# Altium project Tuna_Hub.PrjPcb
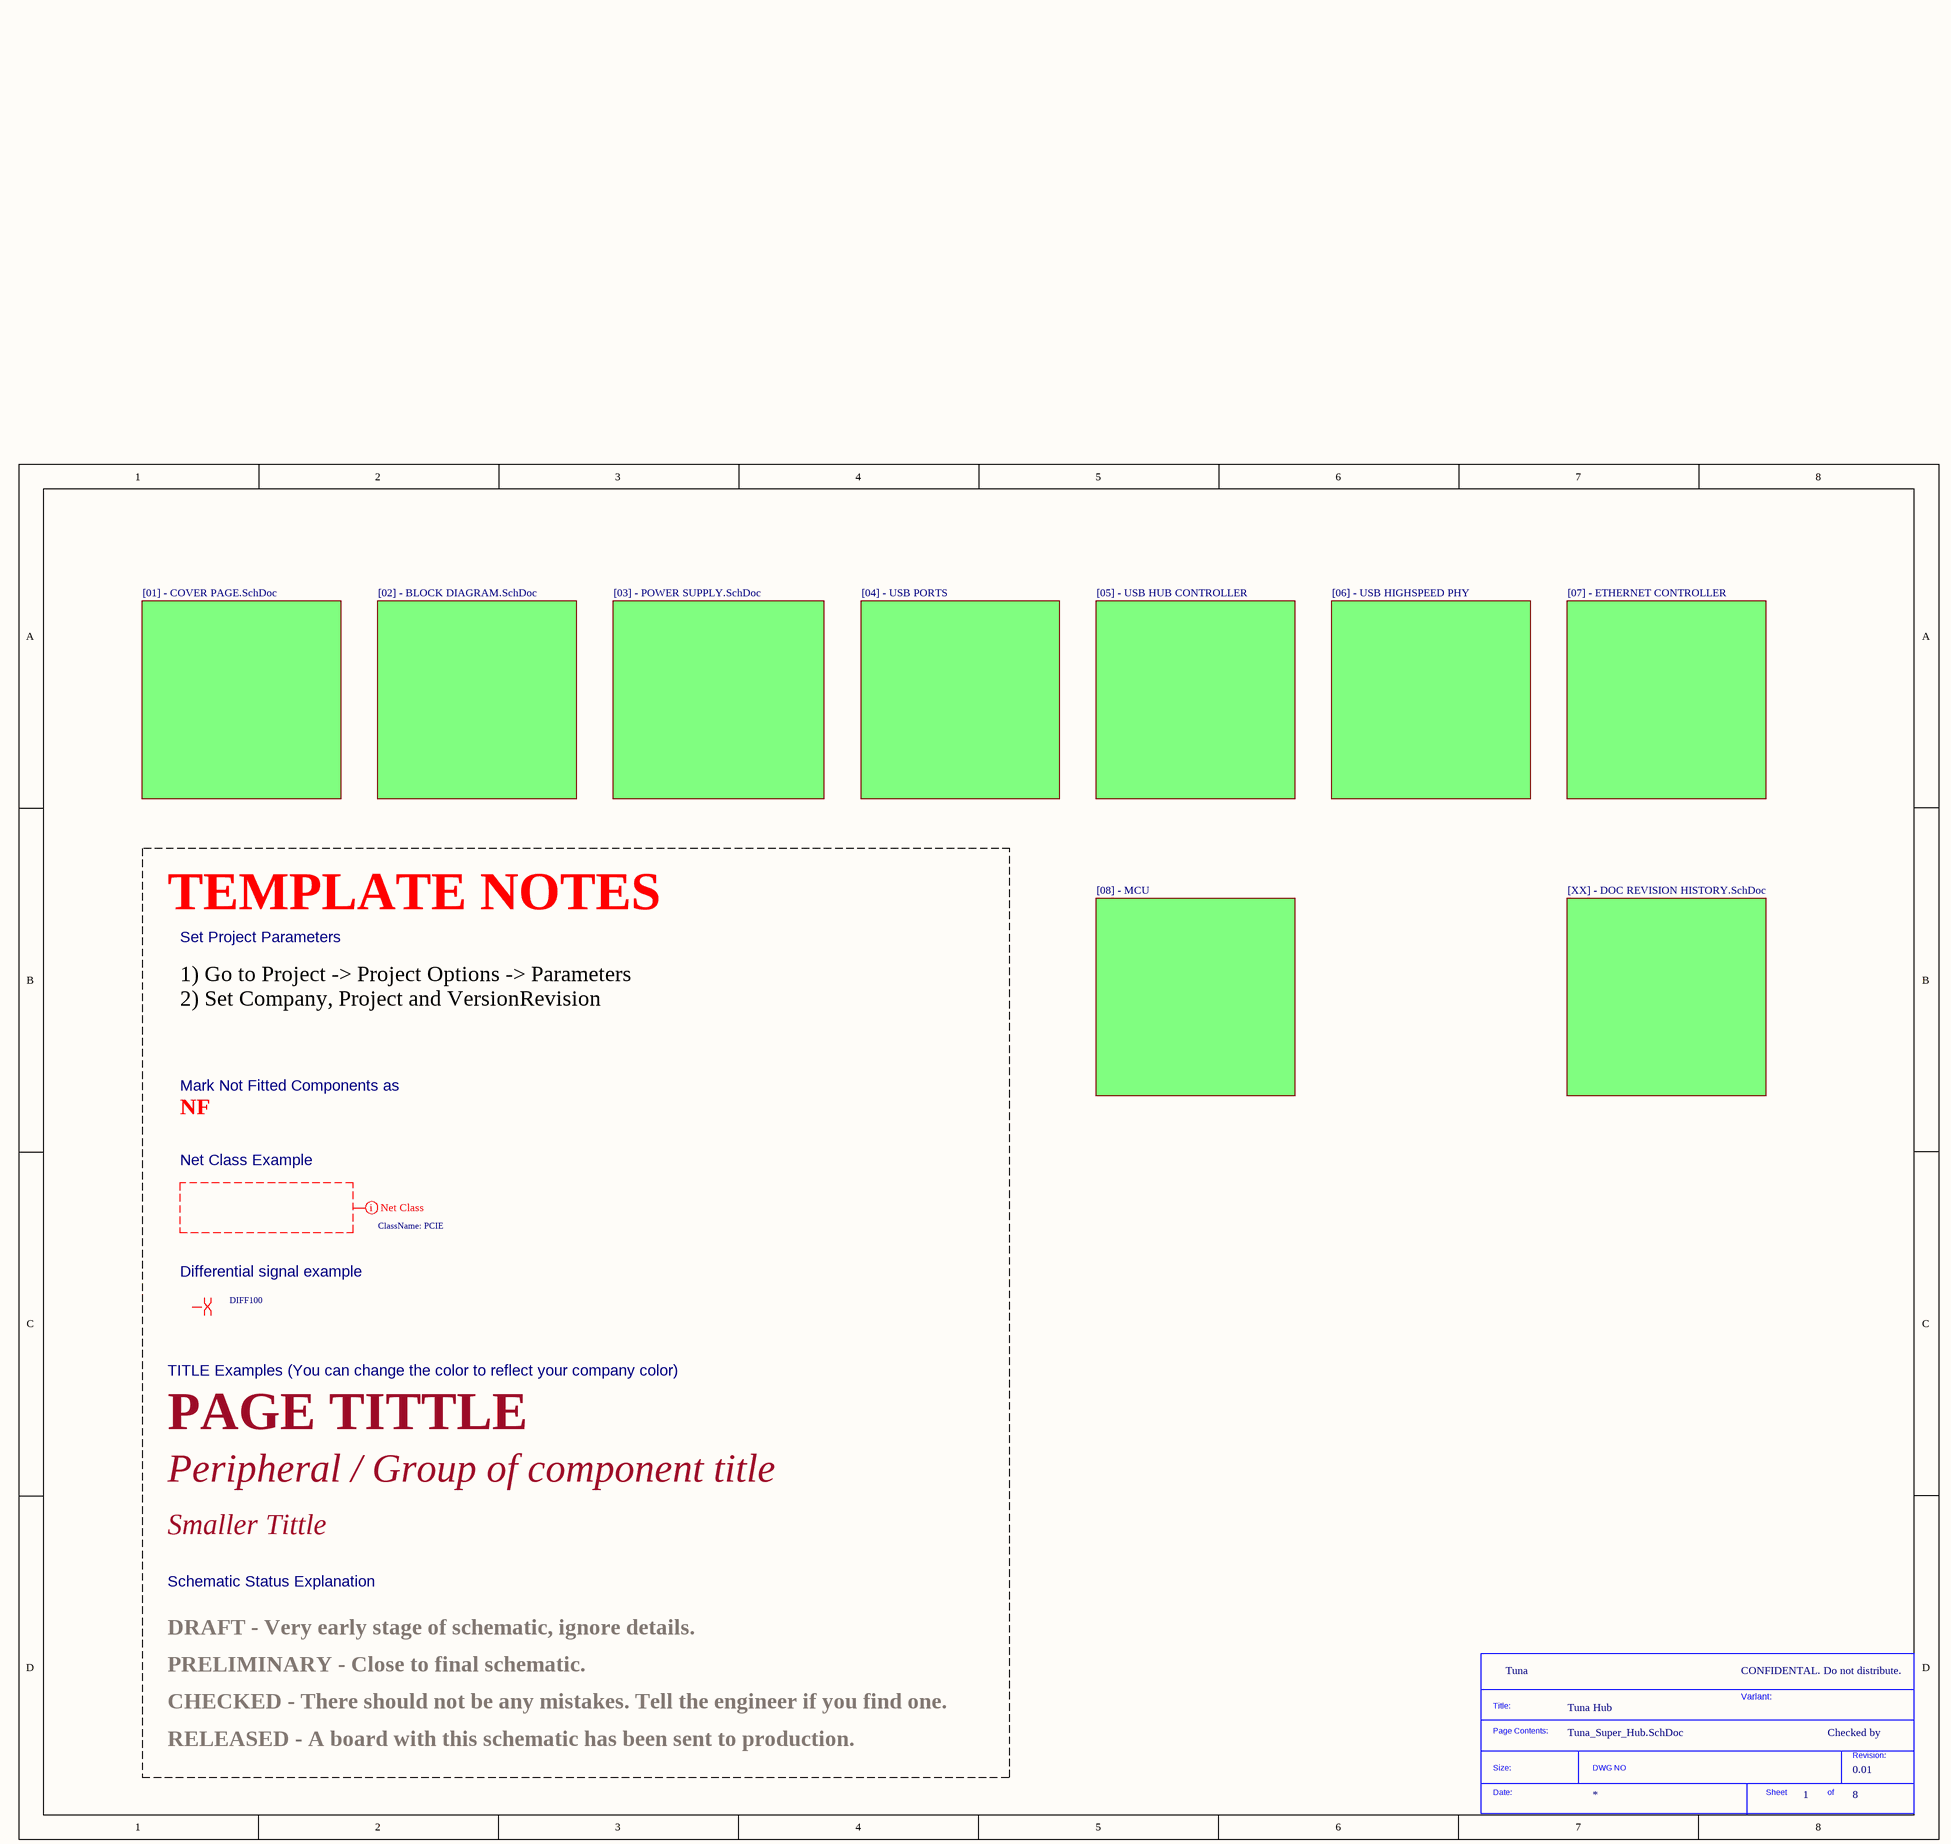
[diagram p0: Tuna_Super_Hub.SchDoc]
Company: Tuna; Project: Tuna Hub; VersionRevision: 0.01
8 sheets, 112 parts. Net scope: flat (ports and power ports of the same name join across sheets).
Board file: PROJECT_NAME_PCB_V1I1.PcbDoc
Sheets:
  Tuna_Super_Hub.SchDoc
    Designator = [01] - COVER PAGE.SchDoc
    U_[03] - POWER SUPPLY = [03] - POWER SUPPLY.SchDoc
    Designator = [05] - USB HUB CONTROLLER.SchDoc
    Designator = [07] - ETHERNET CONTROLLER.SchDoc
    Designator = [06] - USB HIGHSPEED PHY.SchDoc
    Designator = [04] - USB PORTS.SchDoc
    Designator = [08] - MCU.SchDoc

## Sheet Tuna_Super_Hub.SchDoc
size A3; CompanyName: KDS; Organization: KDS; DocumentNumber: 4; Revision: V1I1; SheetNumber: 1; SheetTotal: 8; PageSetup: Record=PageOptions|CenterHorizontal=True|CenterVertical=True|PrintScale=1.07|XCorrection=1.00|YCorrection=1.00|PrintKind=1|BorderSize=5000000|LeftOffset=0|BottomOffset=0|Orientation=2|PaperLength=1000|PaperWidth=1000|Scale=100|PaperSource=7|PrintQuality=600|MediaType=1|DitherType=10|PaperKind=A3|PrintScaleMode=1; ProjectName: KDS C6A816x Module

### Parts
(Parts that share a designator on the sheet are numbered #1, #2 ... from top to bottom, then left to right.)
*#1  SDTitleBlock  (value not drawn)  (graphical)

### Sub-sheets
Designator = [01] - COVER PAGE.SchDoc: no entries
Designator = [02] - BLOCK DIAGRAM.SchDoc (file not in this document): no entries
Designator = [XX] - DOC REVISION HISTORY.SchDoc (file not in this document): no entries
Designator = [05] - USB HUB CONTROLLER: no entries
Designator = [07] - ETHERNET CONTROLLER: no entries
Designator = [06] - USB HIGHSPEED PHY: no entries
Designator = [04] - USB PORTS: no entries
Designator = [08] - MCU: no entries
U_[03] - POWER SUPPLY = [03] - POWER SUPPLY.SchDoc: no entries

### Layout directives
net class PCIE: (no net found under the mark)
differential pair; net class DIFF100: (no net found under the mark)

### Notes on the sheet
- TEMPLATE NOTES
- Set Project Parameters
- 1) Go to Project -> Project Options -> Parameters
  2) Set Company, Project and VersionRevision
- NF
- Mark Not Fitted Components as
- Net Class Example
- Differential signal example
- TITLE Examples (You can change the color to reflect your company color)
- PAGE TITTLE
- Peripheral / Group of component title
- Smaller Tittle
- Schematic Status Explanation
- PRELIMINARY - Close to final schematic.
- DRAFT - Very early stage of schematic, ignore details.
- CONFIDENTAL. Do not distribute.
- CHECKED - There should not be any mistakes. Tell the engineer if you find one.
- Variant:
- Checked by
- RELEASED - A board with this schematic has been sent to production.
- (in symbol SDTitleBlock) Title:; Page Contents:; Revision:; Size:; DWG NO; Date:; Sheet; of

## Sheet [01] - COVER PAGE.SchDoc
size A3; DocumentNumber: 1; SheetNumber: 2; SheetTotal: 9
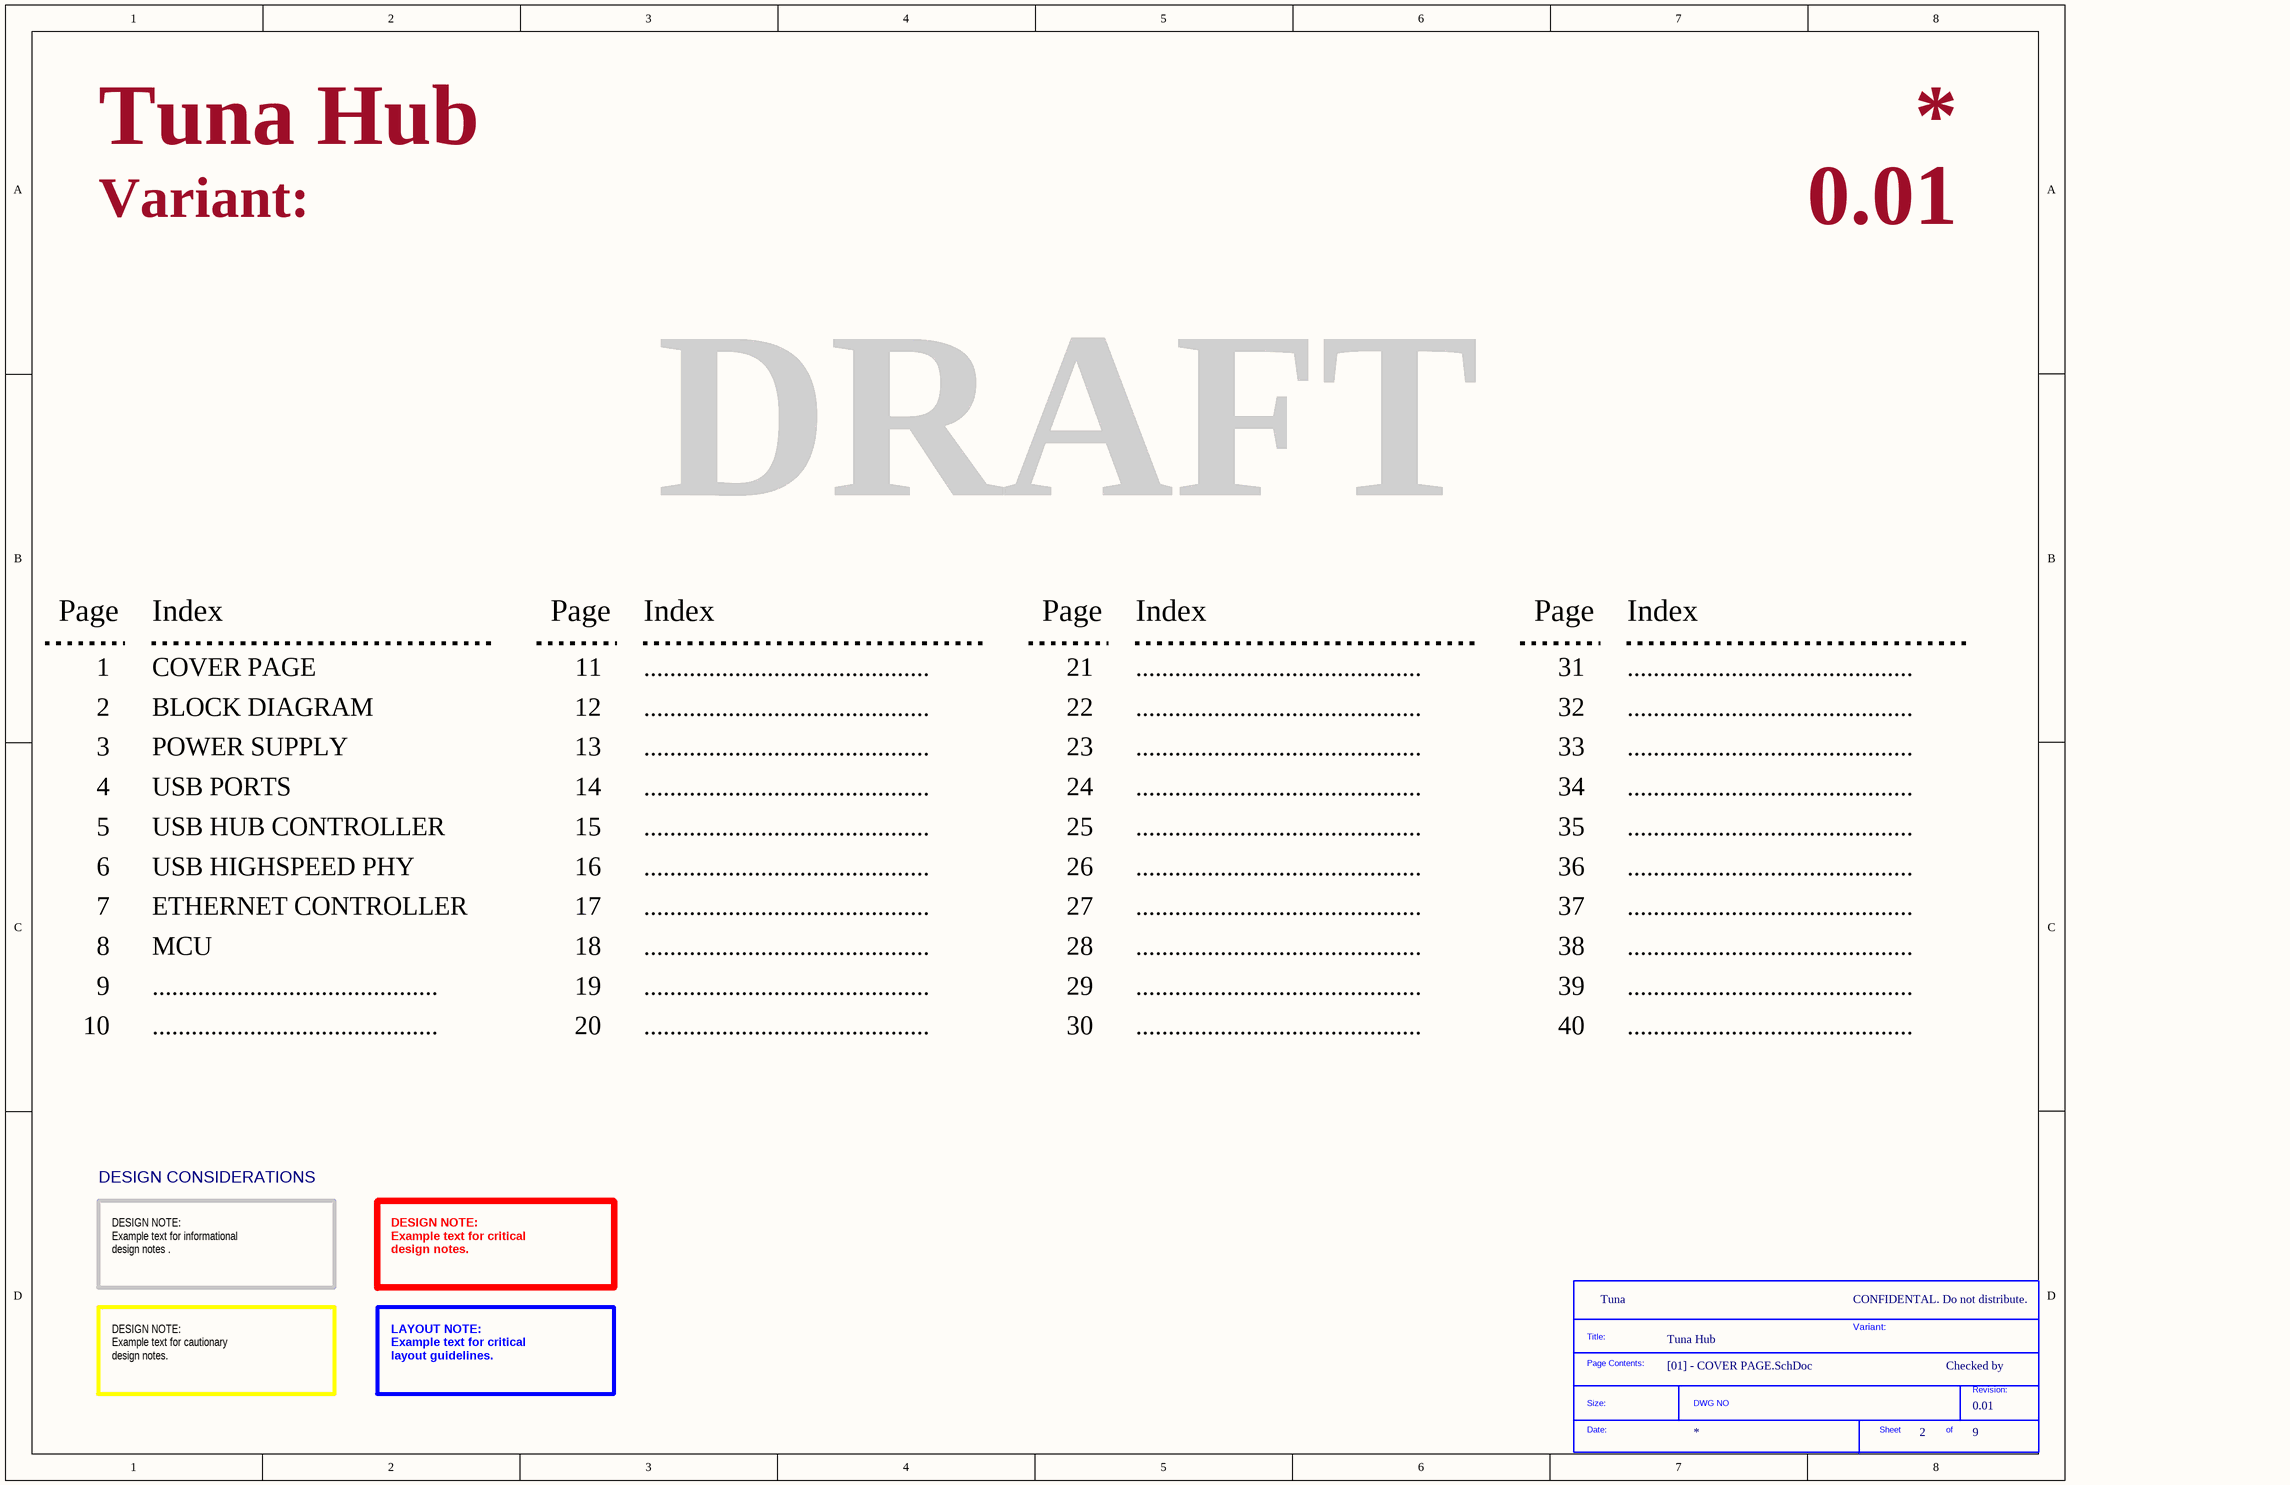
[diagram p1: [01] - COVER PAGE.SchDoc]

### Parts
(Parts that share a designator on the sheet are numbered #1, #2 ... from top to bottom, then left to right.)
*#2  SDTitleBlock  (value not drawn)  (graphical)

### Notes on the sheet
- Variant:
- DRAFT
- Page
- Index
- 1
- COVER PAGE
- 11
- ............................................
- 21
- 31
- 2
- 3
- BLOCK DIAGRAM
- POWER SUPPLY
- 12
- 13
- 22
- 23
- 32
- 33
- 4
- 5
- USB PORTS
- USB HUB CONTROLLER
- 14
- 15
- 24
- 25
- 34
- 35
- 6
- USB HIGHSPEED PHY
- 16
- 26
- 36
- 7
- 8
- ETHERNET CONTROLLER
- MCU
- 17
- 18
- 27
- 28
- 37
- 38
- 9
- 10
- 19
- 20
- 29
- 30
- 39
- 40
- DESIGN CONSIDERATIONS
- DESIGN NOTE:
  Example text for informational
  design notes .
- DESIGN NOTE:
  Example text for critical
  design notes.
- CONFIDENTAL. Do not distribute.
- Checked by
- DESIGN NOTE:
  Example text for cautionary
  design notes.
- LAYOUT NOTE:
  Example text for critical
  layout guidelines.
- (in symbol SDTitleBlock) Title:; Page Contents:; Revision:; Size:; DWG NO; Date:; Sheet; of

## Sheet [03] - POWER SUPPLY.SchDoc
size A3; DocumentNumber: 2; SheetNumber: 3; SheetTotal: 9
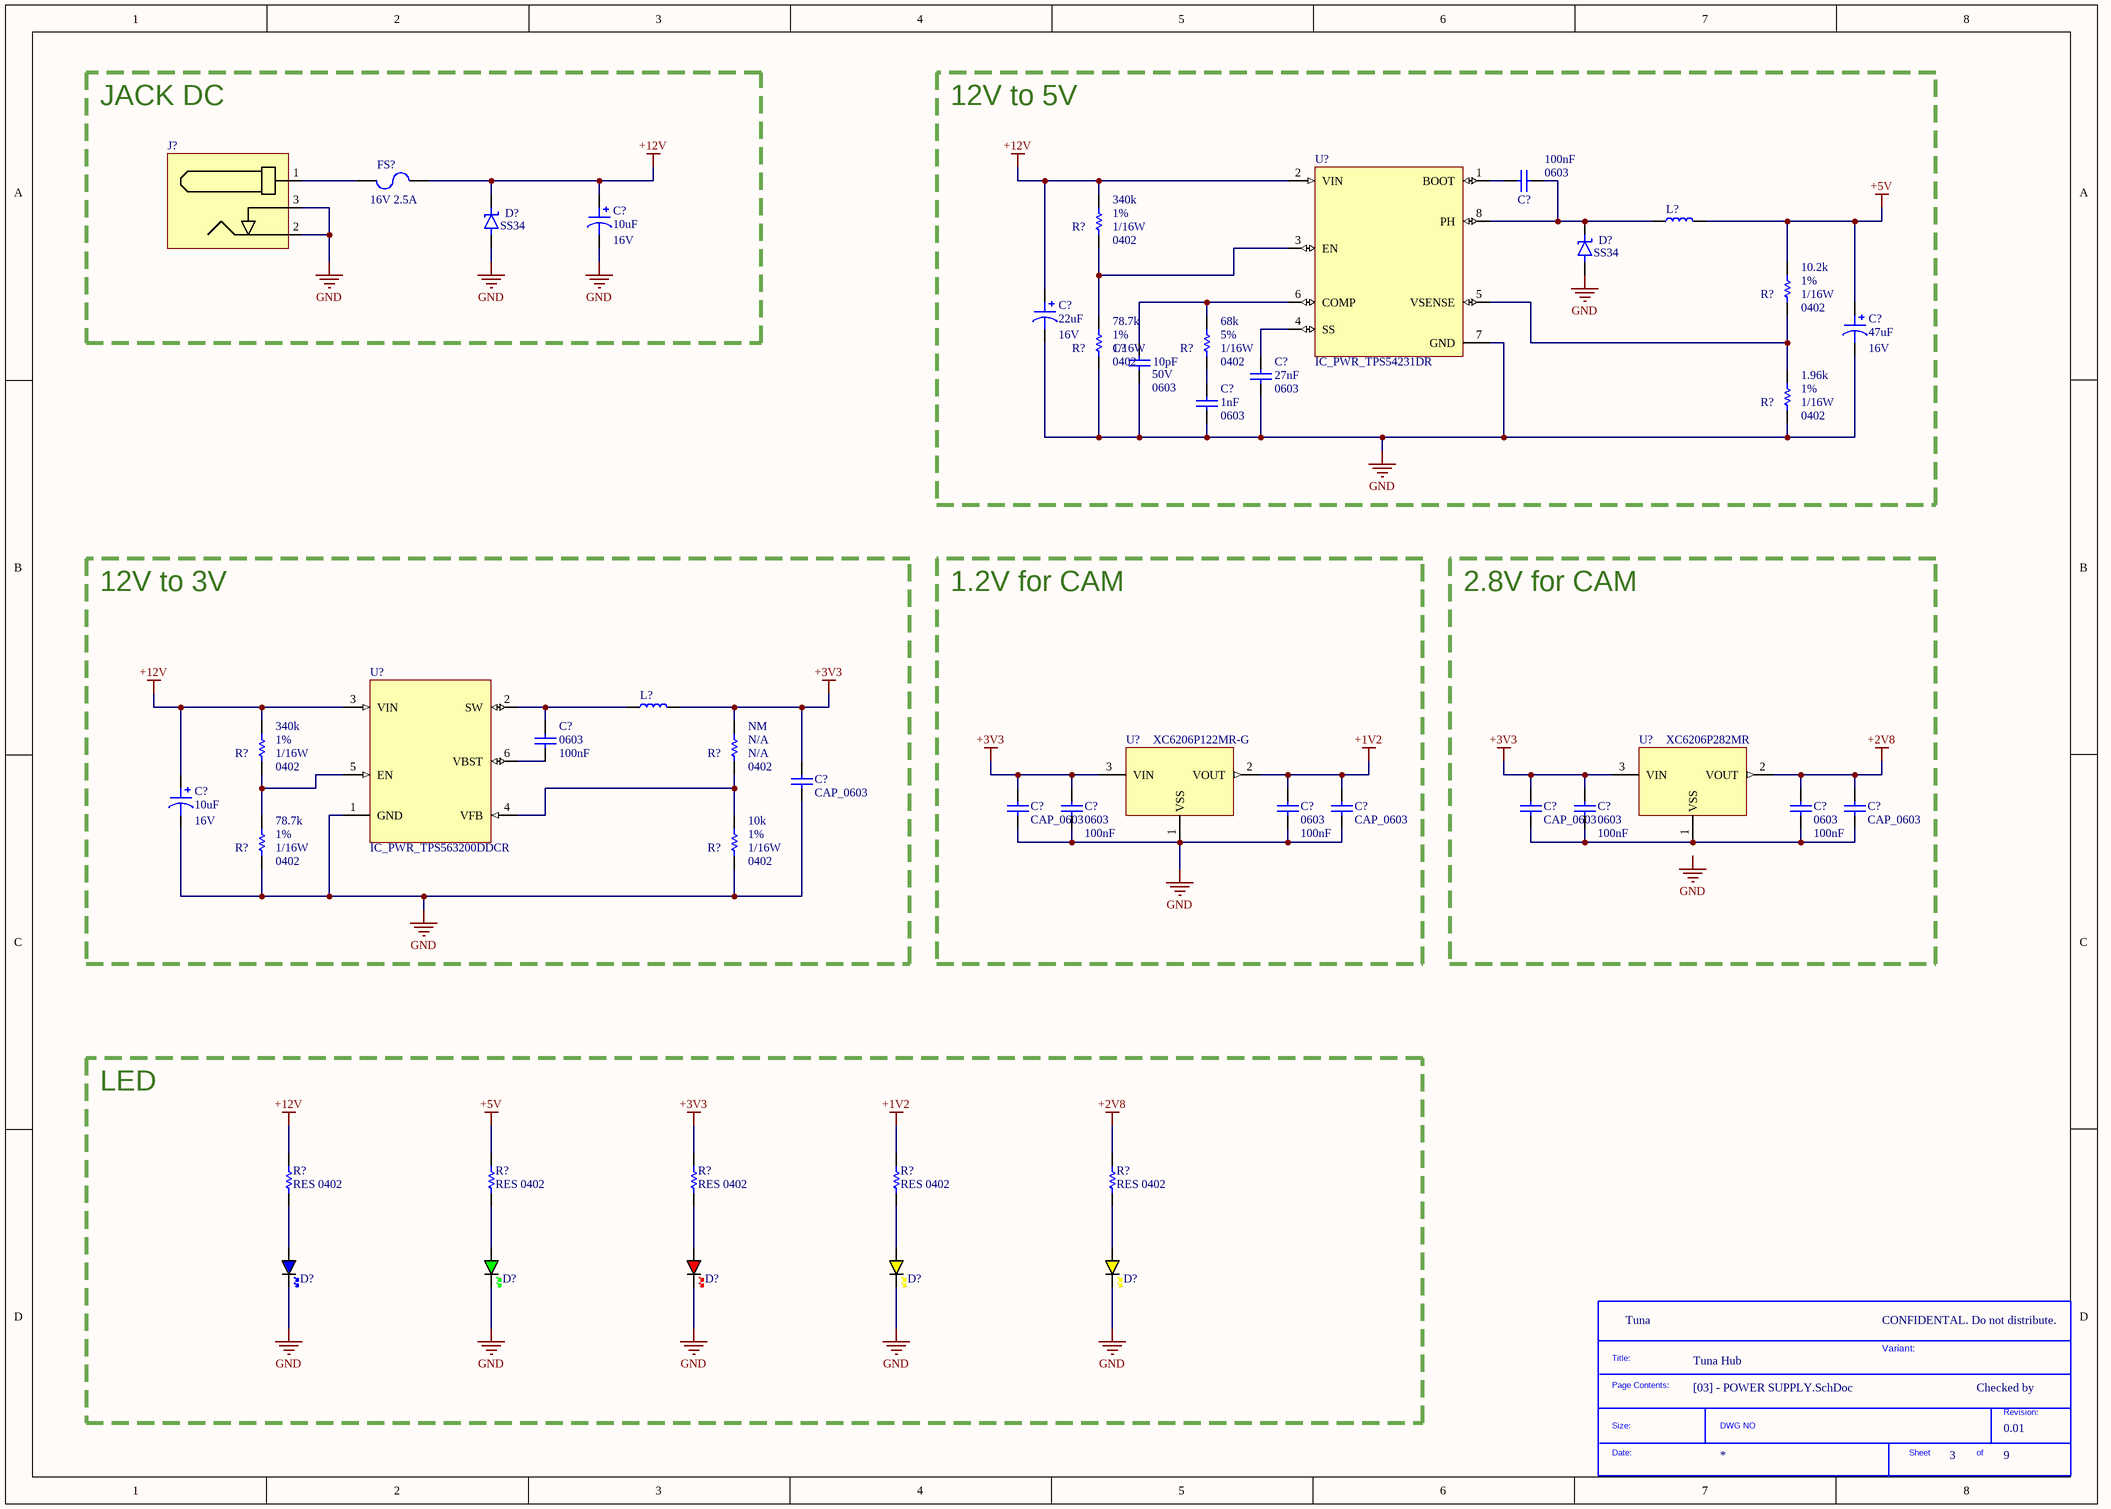
[diagram p2: [03] - POWER SUPPLY.SchDoc]

### Parts
(Parts that share a designator on the sheet are numbered #1, #2 ... from top to bottom, then left to right.)
*#3  SDTitleBlock  (value not drawn)  (graphical)
C?#1  Package / Case: 0603  Capacitance: 100nF  [CAP_0603]  (hidden comment: CAP_0603)
C?#2  10uF  Voltage Rating DC: 16V  [CAP TAN 1411]
C?#3  22uF  Voltage Rating DC: 16V  [CAP_TAN-2312]
C?#4  47uF  Voltage Rating DC: 16V  [CAP_TAN-2312]
C?#5  Voltage Rating DC: 50V  Package / Case: 0603  Capacitance: 10pF  [CAP_0603]  (hidden comment: CAP_0603)
C?#6  Package / Case: 0603  Capacitance: 27nF  [CAP_0603]  (hidden comment: CAP_0603)
C?#7  Package / Case: 0603  Capacitance: 1nF  [CAP_0603]  (hidden comment: CAP_0603)
C?#8  Package / Case: 0603  Capacitance: 100nF  [CAP_0603]  (hidden comment: CAP_0603)
C?#9  Package / Case: 0603  Capacitance: 100nF  [CAP_0603]  (hidden comment: CAP_0603)
C?#10  Package / Case: 0603  Capacitance: 100nF  [CAP_0603]  (hidden comment: CAP_0603)
C?#11  Package / Case: 0603  Capacitance: 100nF  [CAP_0603]  (hidden comment: CAP_0603)
C?#12  Package / Case: 0603  Capacitance: 100nF  [CAP_0603]  (hidden comment: CAP_0603)
C?#13  10uF  Voltage Rating DC: 16V  [CAP TAN 1206]
C?#14  CAP_0603  [CAP_0603]
C?#15  CAP_0603  [CAP_0603]
C?#16  CAP_0603  [CAP_0603]
C?#17  CAP_0603  [CAP_0603]
C?#18  CAP_0603  [CAP_0603]
D?#1  SS34  [DO-214AC-2 (SMA)]
D?#2  SS34  [DO-214AC-2 (SMA)]
D?#3  BLUE  [LED_0603_BLUE]  (value not drawn)
D?#4  GREEN  [LED_0603_GREEN]  (value not drawn)
D?#5  RED  [LED_0603_BLUE]  (value not drawn)
D?#6  YELLOW  [LED_0603_YELLOW]  (value not drawn)
D?#7  YELLOW  [LED_0603_YELLOW]  (value not drawn)
FS?  16V 2.5A  [FUSE_1812]
J?#1  DC-005-5A-3.0  [CONN_PWR_DC-005-5A-3.0]  (value not drawn)
L?#1  L0603  [IND_0603]  (value not drawn)
L?#2  L0402  [IND_0402]  (value not drawn)
R?#1  Tolerance: 1%  Rated Power: 1/16W  Package / Case: 0402  Resistance: 340k  [RES_0402]  (hidden comment: RES 0402)
R?#2  Tolerance: 1%  Rated Power: 1/16W  Package / Case: 0402  Resistance: 10.2k  [RES_0402]  (hidden comment: RES 0402)
R?#3  Tolerance: 1%  Rated Power: 1/16W  Package / Case: 0402  Resistance: 78.7k  [RES_0402]  (hidden comment: RES 0402)
R?#4  Tolerance: 5%  Rated Power: 1/16W  Package / Case: 0402  Resistance: 68k  [RES_0402]  (hidden comment: RES 0402)
R?#5  Tolerance: 1%  Rated Power: 1/16W  Package / Case: 0402  Resistance: 1.96k  [RES_0402]  (hidden comment: RES 0402)
R?#6  Tolerance: 1%  Rated Power: 1/16W  Package / Case: 0402  Resistance: 340k  [RES_0402]  (hidden comment: RES 0402)
R?#7  Package / Case: 0402  Resistance: NM  [RES_0402]  (hidden comment: RES 0402)
R?#8  Tolerance: 1%  Rated Power: 1/16W  Package / Case: 0402  Resistance: 78.7k  [RES_0402]  (hidden comment: RES 0402)
R?#9  Tolerance: 1%  Rated Power: 1/16W  Package / Case: 0402  Resistance: 10k  [RES_0402]  (hidden comment: RES 0402)
R?#10  RES 0402  [RES_0402]
R?#11  RES 0402  [RES_0402]
R?#12  RES 0402  [RES_0402]
R?#13  RES 0402  [RES_0402]
R?#14  RES 0402  [RES_0402]
U?#1  IC_PWR_TPS54231DR  [PKG_SOIC-8]
U?#2  IC_PWR_TPS563200DDCR  [PKG_SOT-23-6]
U?#3  XC6206P122MR-G  [PKG_SOT-23-3]
U?#4  XC6206P282MR  [PKG_SOT-23-3]

### Blocks framed on the sheet
JACK DC: C?#2 D?#1 FS? J?#1
12V to 5V: C?#1 C?#3-C?#7 D?#2 L?#1 R?#1-R?#5 U?#1
12V to 3V: C?#8 C?#13 C?#14 L?#2 R?#6-R?#9 U?#2
1.2V for CAM: C?#9 C?#10 C?#15 C?#16 U?#3
2.8V for CAM: C?#11 C?#12 C?#17 C?#18 U?#4
LED: D?#3-D?#7 R?#10-R?#14

### Nets
+1V2: C?#10.1 C?#16.2 R?#13.2 U?#3.2(VOUT)
+2V8: C?#12.1 C?#18.2 R?#14.2 U?#4.2(VOUT)
+3V3: C?#9.1 C?#11.1 C?#14.2 C?#15.2 C?#17.2 L?#2.2 R?#7.2 R?#12.2 U?#3.3(VIN) U?#4.3(VIN)  [project net RTDC]
+5V: C?#4.1 L?#1.2 R?#2.2 R?#11.2
+12V: C?#2.1 C?#3.1 C?#13.1 D?#1.K FS?.2 R?#1.2 R?#6.2 R?#10.2 U?#1.2(VIN) U?#2.3(VIN)
GND: C?#2.2 C?#3.2 C?#4.2 C?#5.1 C?#6.1 C?#7.1 C?#9.2 C?#10.2 C?#13.2 C?#14.1 C?#15.1 C?#16.1 D?#1.A D?#2.A D?#3.K D?#4.K D?#5.K D?#6.K D?#7.K J?#1.2 J?#1.3 R?#3.1 R?#5.1 R?#8.1 R?#9.1 U?#1.7(GND) U?#2.1(GND) U?#3.1(VSS)
NetC?#1_1: C?#1.1 D?#2.K L?#1.1 U?#1.8(PH)
NetC?#1_2: C?#1.2 U?#1.1(BOOT)
NetC?#5_2: C?#5.2 R?#4.2 U?#1.6(COMP)
NetC?#6_2: C?#6.2 U?#1.4(SS)
NetC?#7_2: C?#7.2 R?#4.1
NetC?#8_1: C?#8.1 L?#2.1 U?#2.2(SW)
NetC?#8_2: C?#8.2 U?#2.6(VBST)
NetC?#11_2: C?#11.2 C?#12.2 C?#17.1 C?#18.1 U?#4.1(VSS)
NetD?#3_A: D?#3.A R?#10.1
NetD?#4_A: D?#4.A R?#11.1
NetD?#5_A: D?#5.A R?#12.1
NetD?#6_A: D?#6.A R?#13.1
NetD?#7_A: D?#7.A R?#14.1
NetFS?_1: FS?.1 J?#1.1
NetR?#1_1: R?#1.1 R?#3.2 U?#1.3(EN)
NetR?#2_1: R?#2.1 R?#5.2 U?#1.5(VSENSE)
NetR?#6_1: R?#6.1 R?#8.2 U?#2.5(EN)
NetR?#7_1: R?#7.1 R?#9.2 U?#2.4(VFB)

### Notes on the sheet
- CLOCKS (CPU & PCIE)
- CONFIDENTAL. Do not distribute.
- Variant:
- Checked by
- Labels drawn without touching a wire or pin: GND
- (in symbol SDTitleBlock) Title:; Page Contents:; Revision:; Size:; DWG NO; Date:; Sheet; of

### Library data of the parts
C?#1 C?#6 C?#8-C?#12 = CAP_0603_NM: CAP, size 0603, NM, N/A; Tolerance: 10%; Voltage Rating DC: 50V; Packaging: Tape and Reel; Supplier: thegioiic; ComponentLink1Description: Datasheet; ComponentLink1URL: N/A; Mount: SMD/SMT; Operating Temperature Max: + 85 C; Operating Temperature Min: - 40 C
  C?#1 C?#8-C?#12: Supplier URL: https://www.thegioiic.com/tu-gom-0603-100nf-0-1uf-50v; Supplier Part Number: Tụ Gốm 0603 100nF (0.1uF) 50V
  C?#6: Supplier URL: https://www.thegioiic.com/tu-gom-0603-27nf-50v; Supplier Part Number: Tụ Gốm 0603 27nF 50V
C?#2-C?#4 = CAP_POL_NM: CAP, size NM, NM, N/A; Tolerance: 10%; Packaging: Tape and Reel; Supplier: thegioiic; ComponentLink1Description: Datasheet; ComponentLink1URL: N/A; Mount: SMD/SMT; Operating Temperature Max: + 85 C; Operating Temperature Min: - 40 C; Material: NM
  C?#2: Capacitance: 10uF; Supplier URL: https://www.thegioiic.com/tu-tantalum-10uf-16v-1206-taja106k016rnj; Supplier Part Number: TAJA106K016RNJ; Package / Case: N/A
  C?#3: Capacitance: 22uF; Supplier URL: https://www.thegioiic.com/tu-tantalum-22uf-16v-2312-tajc226k016rnj; Supplier Part Number: TAJC226K016RNJ; Package / Case: 2312
  C?#4: Capacitance: 47uF; Supplier URL: https://www.thegioiic.com/tu-tantalum-47uf-16v-2312-tajc476k016rnj; Supplier Part Number: TAJC476K016RNJ; Package / Case: 2312
C?#5 = CAP_0603_NM: CAP, size 0603, NM, N/A; Tolerance: 10%; Packaging: Tape and Reel; Supplier URL: https://www.thegioiic.com/tu-gom-0603-10pf-50v; Supplier: thegioiic; Supplier Part Number: Tụ Gốm 0603 10pF 50V; ComponentLink1Description: Datasheet; ComponentLink1URL: N/A; Mount: SMD/SMT; Operating Temperature Max: + 85 C; Operating Temperature Min: - 40 C
C?#7 = CAP_0603_NM: CAP, size 0603, NM, N/A; Tolerance: 10%; Voltage Rating DC: 50; Packaging: Tape and Reel; Supplier URL: https://www.thegioiic.com/tu-gom-0603-1nf-50v; Supplier: thegioiic; Supplier Part Number: Tụ Gốm 0603 1nF 50V; ComponentLink1Description: Datasheet; ComponentLink1URL: N/A; Mount: SMD/SMT; Operating Temperature Max: + 85 C; Operating Temperature Min: - 40 C
C?#13 = CAP_POL_NM: CAP, size NM, NM, N/A; Tolerance: 10%; Material: Tanta; Packaging: Tape and Reel; Capacitance: 10uF; Supplier URL: https://www.thegioiic.com/tu-tantalum-10uf-16v-1206-taja106k016rnj; Supplier: thegioiic; Supplier Part Number: TAJA106K016RNJ; ComponentLink1Description: Datasheet; ComponentLink1URL: N/A; Mount: SMD/SMT; Operating Temperature Max: + 85 C; Operating Temperature Min: - 40 C; Package / Case: 1206
C?#14-C?#18 = CAP_0603_NM: CAP, size 0603, NM, N/A; Packaging: Tape and Reel; Capacitance: N/A; Supplier URL: N/A; Tolerance: N/A; Voltage Rating DC: N/A; Supplier: N/A; Supplier Part Number: N/A; ComponentLink1Description: Datasheet; ComponentLink1URL: N/A; Mount: SMD/SMT; Operating Temperature Max: + 85 C; Operating Temperature Min: - 40 C; Package / Case: 0603
D?#1 D?#2 = D_SCHOTTKY_SMA: Diode Schottky SMD SMA (DO-214AA); Supplier: thegioiic; Supplier Part Number: TWGMC SS34 SMA; Supplier URL: https://www.thegioiic.com/twgmc-ss34-sma-diode-schottky-3a
D?#3 = LED_0603_BLUE: LED 0603 BLUE SMD; COLOR: BLUE; SIZE: 0603; Supplier: N/A; Supplier Part Number: N/A; Supplier URL: N/A
D?#4 = LED_0603_GREEN: LED 0603 GREEN SMD; COLOR: GREEN; SIZE: 0603; Supplier: N/A; Supplier Part Number: N/A; Supplier URL: N/A
D?#5 = LED_0603_RED: LED 0603 RED SMD; COLOR: RED; SIZE: 0603; Supplier: N/A; Supplier Part Number: N/A; Supplier URL: N/A
D?#6 D?#7 = LED_0603_YELLOW: LED 0603 YELLOW SMD; COLOR: YELLOW; SIZE: 0603; Supplier: N/A; Supplier Part Number: N/A; Supplier URL: N/A
FS? = FUSE_1206: Fuse; Supplier backup URL: N/A; Packaging: Tape and Reel; Supplier: thegioiic; Supplier Part Number: MF-MSMF250/16; Supplier backup: N/A; Supplier backup Part Number: N/A; Tolerance: N/A; Manufacturer: N/A; Manufacturer Part Number: N/A; ComponentLink1Description: Datasheet; ComponentLink1URL: N/A; Mount: SMD/SMT; Operating Temperature Max: + 85 C; Operating Temperature Min: - 40 C; Package / Case: 0402; Value: 16V 2.5A; Supplier URL: https://www.thegioiic.com/mf-msmf250-16-cau-chi-tu-phuc-hoi-1812-16v-2-5a
J?#1 = PWR_DC-005-5A-3.0: DC Barrell Jack 6.2mm 5 A3.0mm Through Hole; Supplier: N/A; Supplier Part Number: DC-005-5A-3.0; Supplier URL: N/A
L?#1 = IND_0603: Inductor SMD 0603
L?#2 = IND_SMD: Inductor SMD; Inductance: NM; Current: NM; Supplier: NM; Supplier Part Number: NM; Supplier URL: NM
R?#1 R?#6 = RES_0402_NM: RES, size 0402, NM, N/A; Manufacturer: YAGEO; Manufacturer Part Number: RC0402FR-07340KL; Supplier backup URL: https://www.mouser.vn/ProductDetail/YAGEO/RC0100FR-07340KL?qs=tggtontpCXM9OHWbJDQFHg%3D%3D; Packaging: Tape and Reel; Supplier: Digikey; Supplier Part Number: YAG3121TR-ND; Supplier backup: Mouser; Supplier backup Part Number: 603-RC0100FR-07340KL; ComponentLink1Description: Datasheet; ComponentLink1URL: N/A; Mount: SMD/SMT; Operating Temperature Max: + 85 C; Operating Temperature Min: - 40 C; Supplier URL: https://www.digikey.com/en/products/detail/yageo/RC0402FR-07340KL/5280981
R?#2 = RES_0402_NM: RES, size 0402, NM, N/A; Manufacturer: YAGEO; Manufacturer Part Number: RC0402FR-0710K2L; Supplier backup URL: https://www.mouser.vn/ProductDetail/YAGEO/AC0402FR-0710K2L?qs=sGAEpiMZZMtlubZbdhIBIK4ZiD9DMvaKbrPGG0oO2No%3D; Packaging: Tape and Reel; Supplier: Digikey; Supplier Part Number: YAG2950TR-ND; Supplier backup: Mouser; Supplier backup Part Number: 603-AC0402FR-0710K2L; ComponentLink1Description: Datasheet; ComponentLink1URL: N/A; Mount: SMD/SMT; Operating Temperature Max: + 85 C; Operating Temperature Min: - 40 C; Supplier URL: N/A
R?#3 R?#8 = RES_0402_NM: RES, size 0402, NM, N/A; Manufacturer: YAGEO; Manufacturer Part Number: RT0402BRD0778K7L; Supplier backup URL: https://www.mouser.vn/ProductDetail/YAGEO/AF0402FR-0778K7L?qs=sGAEpiMZZMvdGkrng054t3GzUHVMl1SeZWxuGacPxef8KvweHjVoiA%3D%3D; Packaging: Tape and Reel; Supplier: Digikey; Supplier Part Number: YAG4311TR-ND; Supplier backup: Mouser; Supplier backup Part Number: 603-AF0402FR-0778K7L; ComponentLink1Description: Datasheet; ComponentLink1URL: N/A; Mount: SMD/SMT; Operating Temperature Max: + 85 C; Operating Temperature Min: - 40 C; Supplier URL: https://www.digikey.com/en/products/detail/yageo/RT0402BRD0778K7L/1069393
R?#4 R?#7 R?#9-R?#14 = RES_0402_NM: RES, size 0402, NM, N/A; Supplier backup URL: N/A; Packaging: Tape and Reel; Supplier backup: N/A; Supplier backup Part Number: N/A; ComponentLink1Description: Datasheet; ComponentLink1URL: N/A; Mount: SMD/SMT; Operating Temperature Max: + 85 C; Operating Temperature Min: - 40 C
  R?#4: Supplier: thegioiic; Supplier Part Number: Điện Trở 68 KOhm 0402 5%; LCSC Part #: N/A; Supplier URL: https://www.thegioiic.com/dien-tro-68-kohm-0402-5-
  R?#7: Supplier: N/A; Supplier Part Number: N/A; Manufacturer: N/A; Manufacturer Part Number: N/A; LCSC Part #: N/A; Supplier URL: N/A; Tolerance: N/A; Rated Power: N/A
  R?#9: Supplier: thegioiic; Supplier Part Number: N/A; Manufacturer: N/A; Manufacturer Part Number: N/A; Supplier URL: https://www.thegioiic.com/dien-tro-10-kohm-0402-1-
  R?#10-R?#14: Rated Power: N/A; Supplier: N/A; Supplier Part Number: N/A; Tolerance: N/A; Manufacturer: N/A; Manufacturer Part Number: N/A; Package / Case: 0402; LCSC Part #: N/A; Resistance: NM; Supplier URL: N/A
R?#5 = RES_0402_NM: RES, size 0402, NM, N/A; Manufacturer: YAGEO; Manufacturer Part Number: RC0402FR-071K96L; Supplier backup URL: https://www.mouser.vn/ProductDetail/YAGEO/RT0402FRE071K96L?qs=gY0y7AQI9SNNJ9oB6Obr3g%3D%3D; Packaging: Tape and Reel; Supplier: Digikey; Supplier Part Number: 311-1.96KLRTR-ND; Supplier backup: Mouser; Supplier backup Part Number: 603-RT0402FRE071K96L; ComponentLink1Description: Datasheet; ComponentLink1URL: N/A; Mount: SMD/SMT; Operating Temperature Max: + 85 C; Operating Temperature Min: - 40 C; Supplier URL: https://www.digikey.com/en/products/detail/yageo/RC0402FR-071K96L/726522
U?#1 = IC_PWR_TPS54231DR: 3.5 to 28V Input, 2A, 570kHz Step-Down Converter with Eco-modeâ„¢; Package: SOIC-8 Texas Instruments; Supplier: *; Supplier Part Number: *; Supplier URL: *
U?#2 = IC_PWR_TPS563200DDCR: 17 V Input, 3A Synchronous Step-Down Regulator in SOT-23 with Advanced Eco-modeâ„¢; MF: Texas Instruments; SnapEDA_Link: https://www.snapeda.com/parts/TPS563200DDCR/Texas+Instruments/view-part/?ref=snap; Package: SOT-23-THN-6 Texas Instruments; Value: *; MP: TPS563200DDCR; Check_prices: https://www.snapeda.com/parts/TPS563200DDCR/Texas+Instruments/view-part/?ref=eda
U?#3 = IC_PWR_XC6206P122MR-G: IC REG LINEAR 1.2V 60MA SOT23; Manufacturer_Name: Torex Semiconductor; Copyright: Copyright (C) 2025 Ultra Librarian. All rights reserved.; Manufacturer_Part_Number: XC6206P122MR-G; RefDes: RefDes; Type: Type
U?#4 = IC_PWR_XC6206P282MR: IC REG LINEAR 2.8V 100MA SOT23; Manufacturer_Name: Torex Semiconductor; Manufacturer_Part_Number: XC6206P122MR-G; Copyright: Copyright (C) 2025 Ultra Librarian. All rights reserved.; RefDes: RefDes; Type: Type

## Sheet [05] - USB HUB CONTROLLER.SchDoc
size A4; SheetNumber: 6; SheetTotal: 10
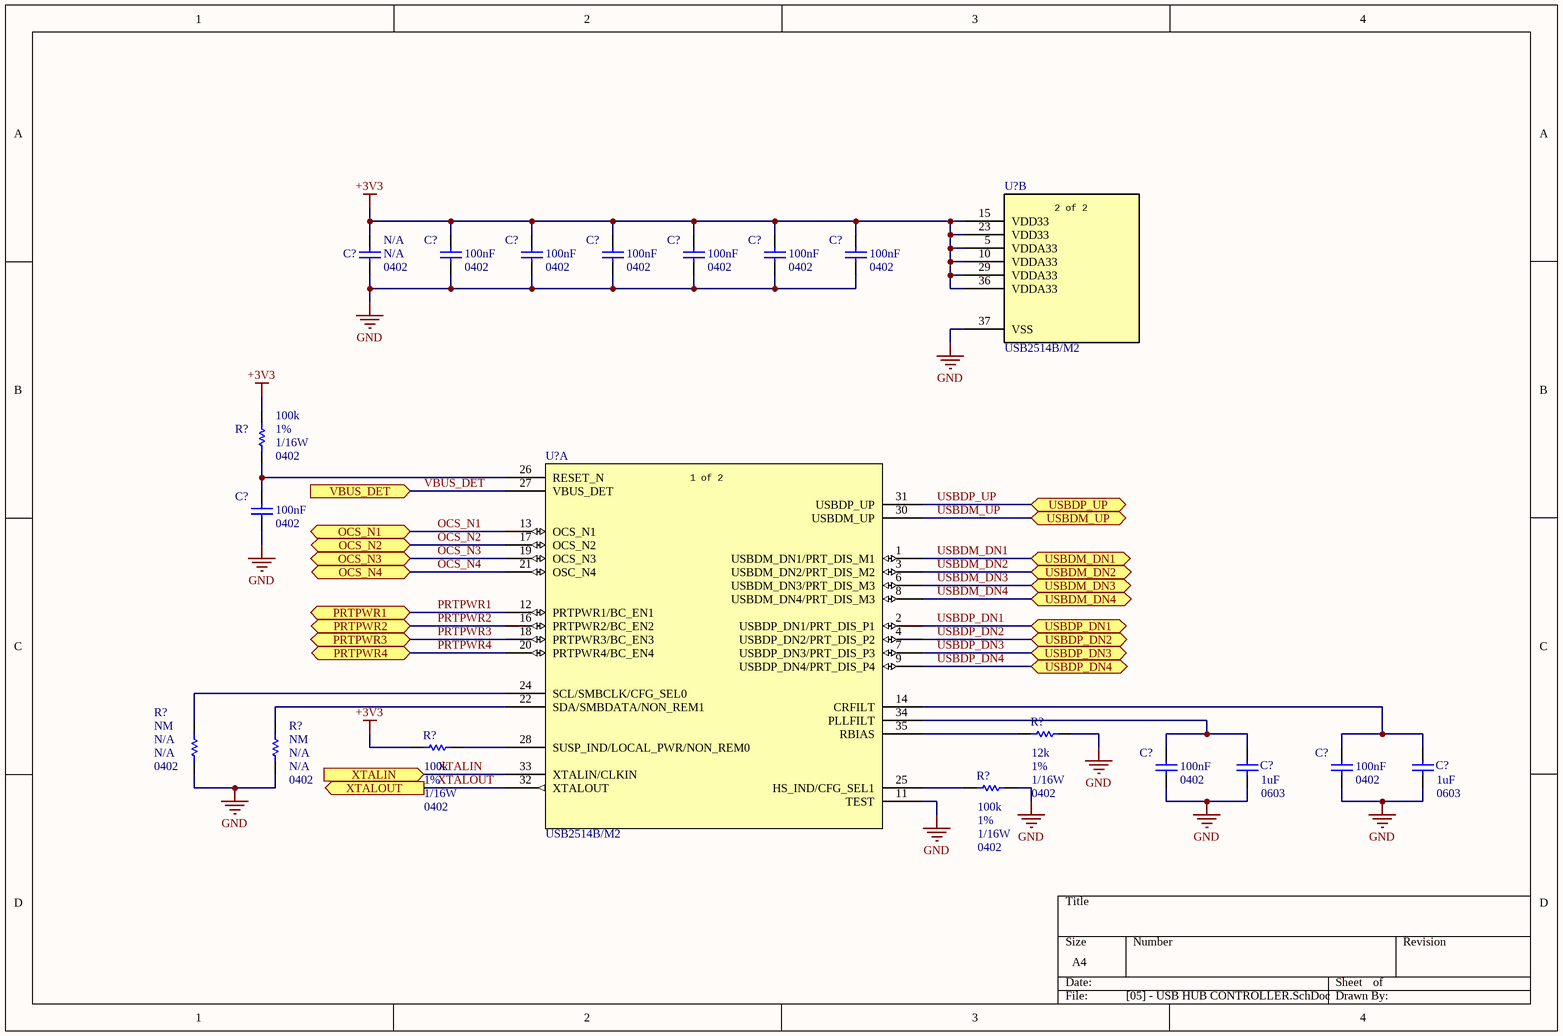
[diagram p3: [05] - USB HUB CONTROLLER.SchDoc]

### Parts
(Parts that share a designator on the sheet are numbered #1, #2 ... from top to bottom, then left to right.)
C?#19  Package / Case: 0402  [CAP_0402]  (hidden comment: CAP 0402)
C?#20  Package / Case: 0402  Capacitance: 100nF  [CAP_0402]  (hidden comment: CAP 0402)
C?#21  Package / Case: 0402  Capacitance: 100nF  [CAP_0402]  (hidden comment: CAP 0402)
C?#22  Package / Case: 0402  Capacitance: 100nF  [CAP_0402]  (hidden comment: CAP 0402)
C?#23  Package / Case: 0402  Capacitance: 100nF  [CAP_0402]  (hidden comment: CAP 0402)
C?#24  Package / Case: 0402  Capacitance: 100nF  [CAP_0402]  (hidden comment: CAP 0402)
C?#25  Package / Case: 0402  Capacitance: 100nF  [CAP_0402]  (hidden comment: CAP 0402)
C?#26  Package / Case: 0402  Capacitance: 100nF  [CAP_0402]  (hidden comment: CAP 0402)
C?#27  Package / Case: 0603  Capacitance: 1uF  [CAP_0603]  (hidden comment: CAP_0603)
C?#28  Package / Case: 0603  Capacitance: 1uF  [CAP_0603]  (hidden comment: CAP_0603)
C?#29  Package / Case: 0402  Capacitance: 100nF  [CAP_0402]  (hidden comment: CAP 0402)
C?#30  Package / Case: 0402  Capacitance: 100nF  [CAP_0402]  (hidden comment: CAP 0402)
R?#15  Tolerance: 1%  Rated Power: 1/16W  Package / Case: 0402  Resistance: 100k  [RES_0402]  (hidden comment: RES 0402)
R?#16  Tolerance: 1%  Rated Power: 1/16W  Package / Case: 0402  Resistance: 12k  [RES_0402]  (hidden comment: RES 0402)
R?#17  Tolerance: 1%  Rated Power: 1/16W  Package / Case: 0402  Resistance: 100k  [RES_0402]  (hidden comment: RES 0402)
R?#18  Package / Case: 0402  Resistance: NM  [RES_0402]  (hidden comment: RES 0402)
R?#19  Package / Case: 0402  Resistance: NM  [RES_0402]  (hidden comment: RES 0402)
R?#20  Tolerance: 1%  Rated Power: 1/16W  Package / Case: 0402  Resistance: 100k  [RES_0402]  (hidden comment: RES 0402)
U?#5  USB2514B/M2  [MC_MCU_USB2514BM2]  (part B of 2)
U?#6  USB2514B/M2  [MC_MCU_USB2514BM2]  (part A of 2)

### Ports
OCS_N1 (bidir), OCS_N2 (bidir), OCS_N3 (bidir), OCS_N4 (bidir), PRTPWR1 (bidir), PRTPWR2 (bidir), PRTPWR3 (bidir), PRTPWR4 (bidir), USBDM_DN1 (bidir), USBDM_DN2 (bidir), USBDM_DN3 (bidir), USBDM_DN4 (bidir), USBDM_UP (bidir), USBDP_DN1 (bidir), USBDP_DN2 (bidir), USBDP_DN3 (bidir), USBDP_DN4 (bidir), USBDP_UP (bidir), VBUS_DET (in), XTALIN (in), XTALOUT (out)

### Nets
+3V3: C?#19.2 C?#20.2 C?#21.2 C?#22.2 C?#23.2 C?#24.2 C?#25.2 R?#15.2 R?#17.2 U?#5.5(VDDA33) U?#5.10(VDDA33) U?#5.15(VDD33) U?#5.23(VDD33) U?#5.29(VDDA33) U?#5.36(VDDA33)  [project net RTDC]
GND: C?#19.1 C?#20.1 C?#21.1 C?#22.1 C?#23.1 C?#24.1 C?#25.1 C?#26.1 C?#27.2 C?#28.2 C?#29.1 C?#30.1 R?#16.1 R?#18.1 R?#19.1 R?#20.1 U?#5.37(VSS) U?#6.11(TEST)
OCS_N1: U?#6.13(OCS_N1) ; port OCS_N1
OCS_N2: U?#6.17(OCS_N2) ; port OCS_N2
OCS_N3: U?#6.19(OCS_N3) ; port OCS_N3
OCS_N4: U?#6.21(OSC_N4) ; port OCS_N4
PRTPWR1: U?#6.12(PRTPWR1/BC_EN1) ; port PRTPWR1
PRTPWR2: U?#6.16(PRTPWR2/BC_EN2) ; port PRTPWR2
PRTPWR3: U?#6.18(PRTPWR3/BC_EN3) ; port PRTPWR3
PRTPWR4: U?#6.20(PRTPWR4/BC_EN4) ; port PRTPWR4
USBDM_DN1: U?#6.1(USBDM_DN1/PRT_DIS_M1) ; port USBDM_DN1
USBDM_DN2: U?#6.3(USBDM_DN2/PRT_DIS_M2) ; port USBDM_DN2
USBDM_DN3: U?#6.6(USBDM_DN3/PRT_DIS_M3) ; port USBDM_DN3
USBDM_DN4: U?#6.8(USBDM_DN4/PRT_DIS_M3) ; port USBDM_DN4
USBDM_UP: U?#6.30(USBDM_UP) ; port USBDM_UP
USBDP_DN1: U?#6.2(USBDP_DN1/PRT_DIS_P1) ; port USBDP_DN1
USBDP_DN2: U?#6.4(USBDP_DN2/PRT_DIS_P2) ; port USBDP_DN2
USBDP_DN3: U?#6.7(USBDP_DN3/PRT_DIS_P3) ; port USBDP_DN3
USBDP_DN4: U?#6.9(USBDP_DN4/PRT_DIS_P4) ; port USBDP_DN4
USBDP_UP: U?#6.31(USBDP_UP) ; port USBDP_UP
VBUS_DET: U?#6.27(VBUS_DET) ; port VBUS_DET
XTALIN: U?#6.33(XTALIN/CLKIN) ; port XTALIN
XTALOUT: U?#6.32(XTALOUT) ; port XTALOUT
NetC?#26_2: C?#26.2 R?#15.1 U?#6.26(RESET_N)
NetC?#27_1: C?#27.1 C?#29.2 U?#6.34(PLLFILT)
NetC?#28_1: C?#28.1 C?#30.2 U?#6.14(CRFILT)
NetR?#16_2: R?#16.2 U?#6.35(RBIAS)
NetR?#17_1: R?#17.1 U?#6.28(SUSP_IND/LOCAL_PWR/NON_REM0)
NetR?#18_2: R?#18.2 U?#6.24(SCL/SMBCLK/CFG_SEL0)
NetR?#19_2: R?#19.2 U?#6.22(SDA/SMBDATA/NON_REM1)
NetR?#20_2: R?#20.2 U?#6.25(HS_IND/CFG_SEL1)

### Notes on the sheet
- (in symbol IC_USB2514BM2, part A) 1 of 2
- (in symbol IC_USB2514BM2, part B) 2 of 2

### Library data of the parts
C?#19 = CAP_0402_NM: CAP, size 0402, NM, N/A; Supplier URL: N/A; Tolerance: N/A; Supplier: N/A; Supplier Part Number: N/A; ComponentLink1Description: Datasheet; ComponentLink1URL: N/A; Mount: SMD/SMT; Operating Temperature Max: + 85 C; Operating Temperature Min: - 40 C; Packaging: Tape and Reel; Voltage Rating DC: N/A; Capacitance: N/A
C?#20-C?#26 C?#29 C?#30 = CAP_0402_NM: CAP, size 0402, NM, N/A; Tolerance: 10%; Voltage Rating DC: 50V; Supplier URL: https://www.thegioiic.com/tu-gom-0402-100nf-0-1uf-50v; Supplier: thegioiic; Supplier Part Number: Tụ Gốm 0402 100nF (0.1uF) 50V; ComponentLink1Description: Datasheet; ComponentLink1URL: N/A; Mount: SMD/SMT; Operating Temperature Max: + 85 C; Operating Temperature Min: - 40 C; Packaging: Tape and Reel
C?#27 C?#28 = CAP_0603_NM: as C?#1 on sheet [03] - POWER SUPPLY; Packaging: Tape and Reel; Supplier URL: https://www.thegioiic.com/tu-gom-0603-1uf-50v; Supplier: thegioiic; Supplier Part Number: Tụ Gốm 0603 1uF 50V; ComponentLink1Description: Datasheet; ComponentLink1URL: N/A; Mount: SMD/SMT; Operating Temperature Max: + 85 C; Operating Temperature Min: - 40 C
R?#15-R?#17 R?#20 = RES_0402_NM: RES, size 0402, NM, N/A; Manufacturer: OEM; Supplier backup URL: N/A; Packaging: Tape and Reel; Supplier backup: N/A; Supplier backup Part Number: N/A; Manufacturer Part Number: N/A; ComponentLink1Description: Datasheet; ComponentLink1URL: N/A; Mount: SMD/SMT; Operating Temperature Max: + 85 C; Operating Temperature Min: - 40 C
  R?#15 R?#17 R?#20: Supplier: thegioiic; Supplier Part Number: Điện Trở 100 KOhm 0402 1%; Supplier URL: https://www.thegioiic.com/dien-tro-100-kohm-0402-1-
  R?#16: Supplier: CXT; Supplier Part Number: C020903; Supplier URL: https://linhkien.cxtvn.com/4697-dien-tro-0402-1-thong-so-tu-1k-den-91k.html
R?#18 R?#19 = RES_0402_NM: RES, size 0402, NM, N/A; Supplier backup URL: N/A; Packaging: Tape and Reel; Supplier: N/A; Supplier Part Number: N/A; Supplier backup: N/A; Supplier backup Part Number: N/A; Manufacturer: N/A; Manufacturer Part Number: N/A; ComponentLink1Description: Datasheet; ComponentLink1URL: N/A; Mount: SMD/SMT; Operating Temperature Max: + 85 C; Operating Temperature Min: - 40 C; LCSC Part #: N/A; Supplier URL: N/A; Tolerance: N/A; Rated Power: N/A
U?#5 U?#6 = IC_USB2514BM2: Description; Manufacturer_Name: Microchip; Copyright: Copyright (C) 2025 Ultra Librarian. All rights reserved.; Manufacturer_Part_Number: USB2514B/M2; RefDes: RefDes; Type: Type

## Sheet [07] - ETHERNET CONTROLLER.SchDoc
size A3; SheetNumber: 8; SheetTotal: 10
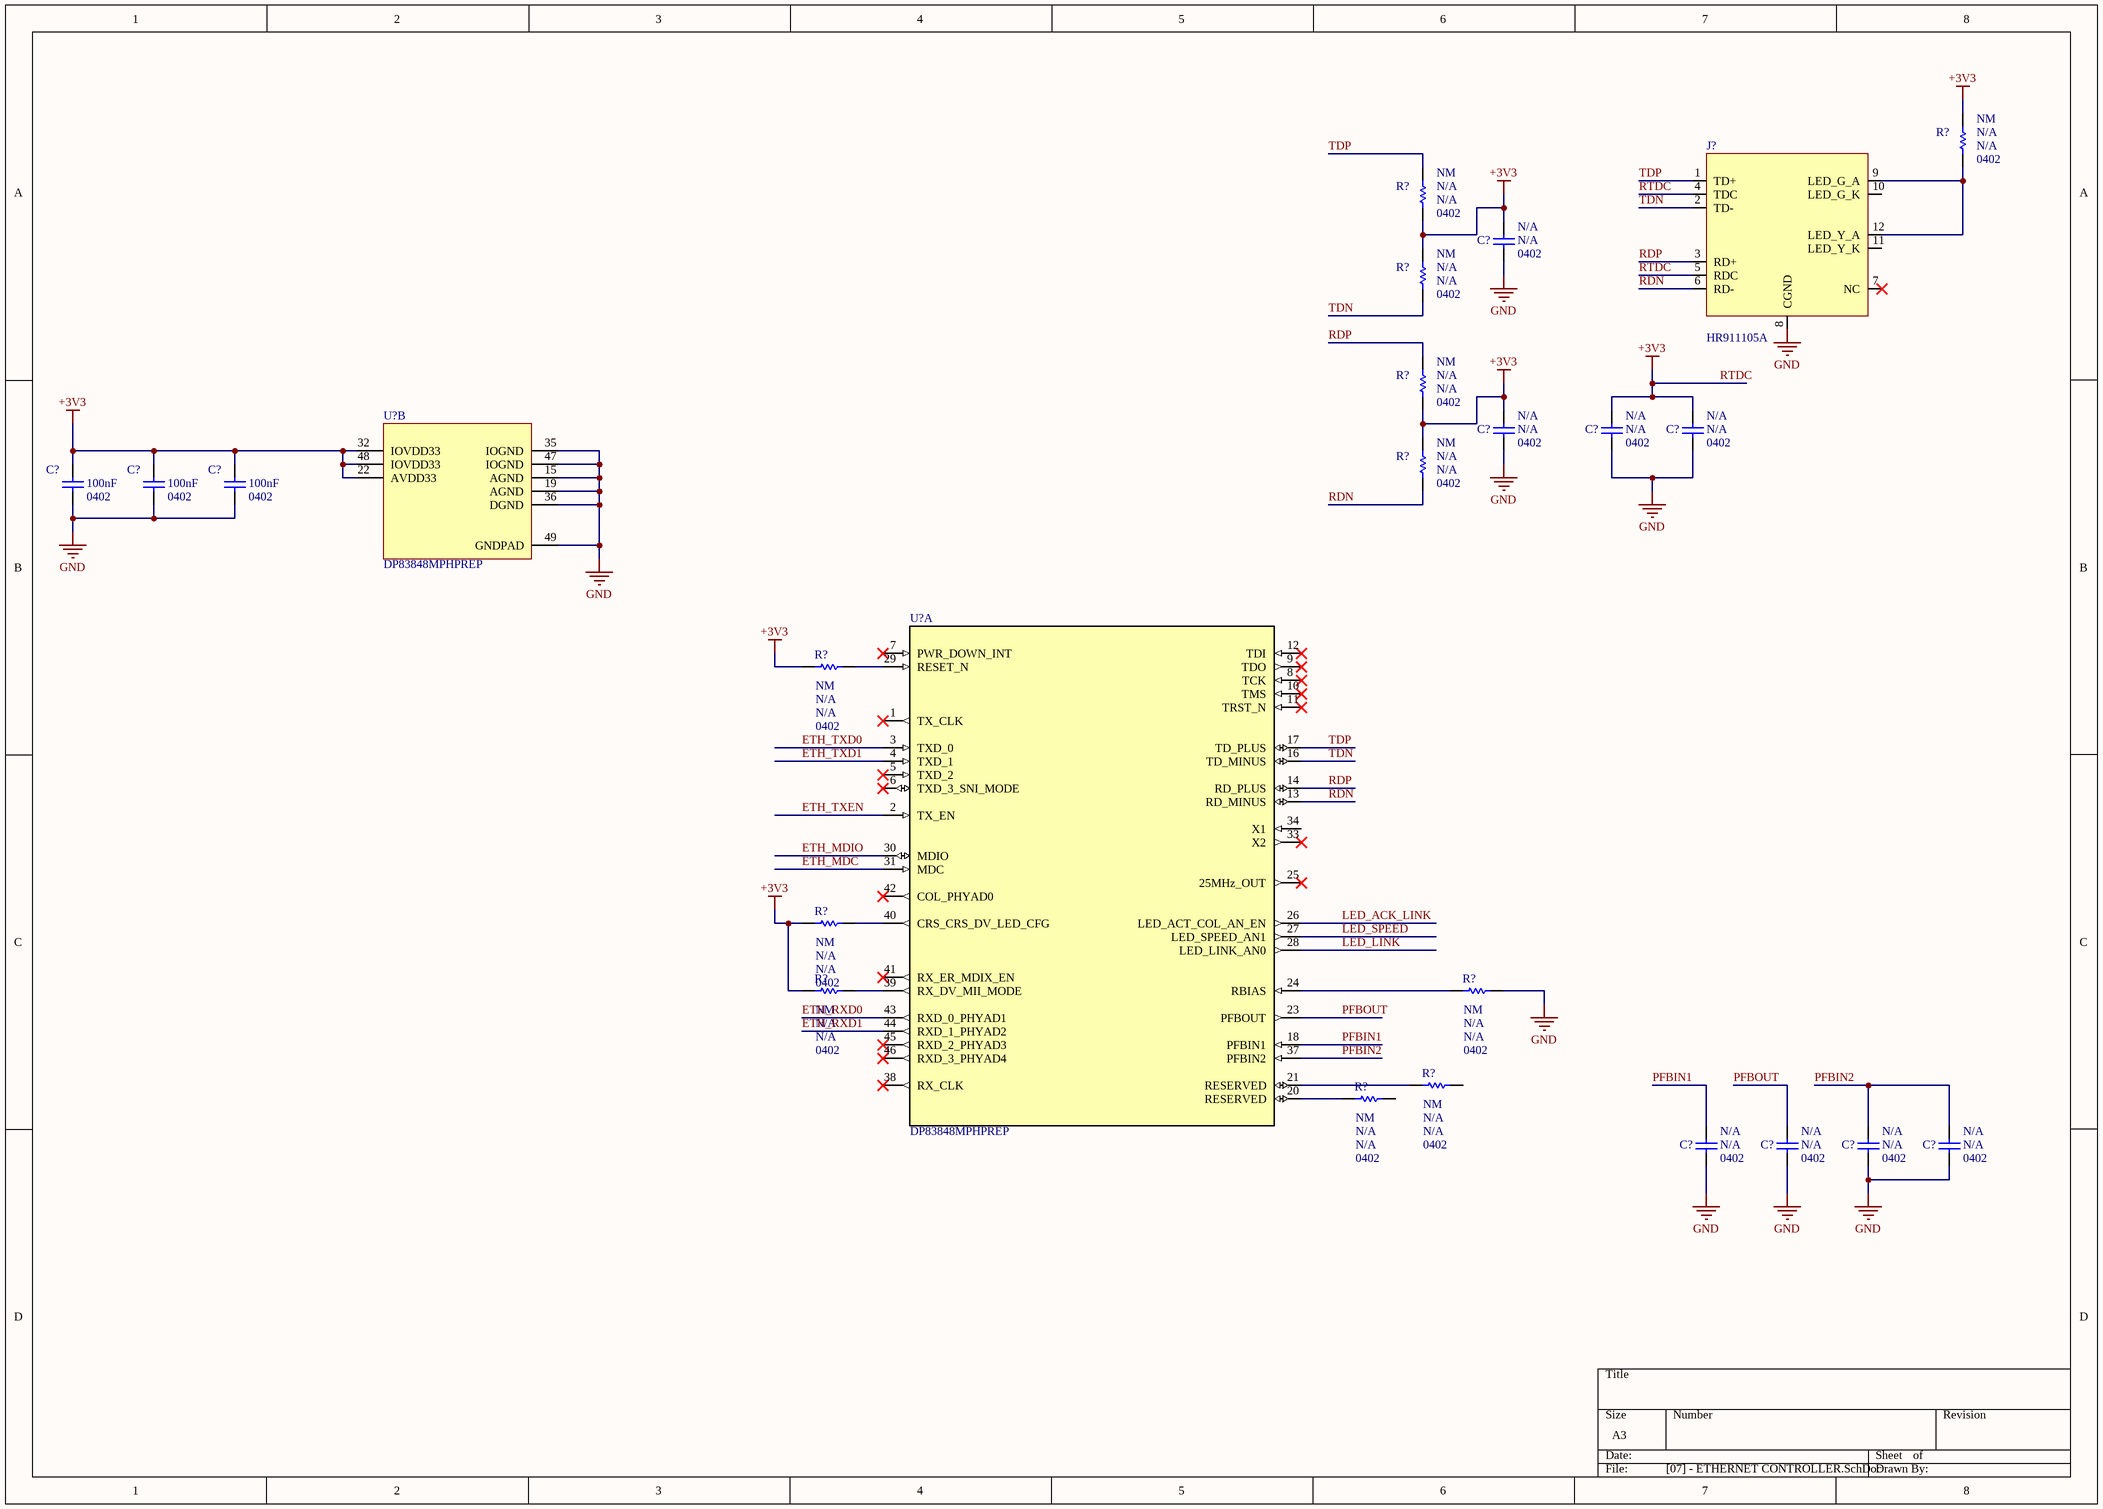
[diagram p4: [07] - ETHERNET CONTROLLER.SchDoc]

### Parts
(Parts that share a designator on the sheet are numbered #1, #2 ... from top to bottom, then left to right.)
C?#31  Package / Case: 0402  [CAP_0402]  (hidden comment: CAP 0402)
C?#32  Package / Case: 0402  [CAP_0402]  (hidden comment: CAP 0402)
C?#33  Package / Case: 0402  [CAP_0402]  (hidden comment: CAP 0402)
C?#34  Package / Case: 0402  [CAP_0402]  (hidden comment: CAP 0402)
C?#35  Package / Case: 0402  Capacitance: 100nF  [CAP_0402]  (hidden comment: CAP 0402)
C?#36  Package / Case: 0402  Capacitance: 100nF  [CAP_0402]  (hidden comment: CAP 0402)
C?#37  Package / Case: 0402  Capacitance: 100nF  [CAP_0402]  (hidden comment: CAP 0402)
C?#38  Package / Case: 0402  [CAP_0402]  (hidden comment: CAP 0402)
C?#39  Package / Case: 0402  [CAP_0402]  (hidden comment: CAP 0402)
C?#40  Package / Case: 0402  [CAP_0402]  (hidden comment: CAP 0402)
C?#41  Package / Case: 0402  [CAP_0402]  (hidden comment: CAP 0402)
J?#2  HR911105A  [CONN_RJ45_HANRUN_HR911105A]
R?#21  Package / Case: 0402  Resistance: NM  [RES_0402]  (hidden comment: RES 0402)
R?#22  Package / Case: 0402  Resistance: NM  [RES_0402]  (hidden comment: RES 0402)
R?#23  Package / Case: 0402  Resistance: NM  [RES_0402]  (hidden comment: RES 0402)
R?#24  Package / Case: 0402  Resistance: NM  [RES_0402]  (hidden comment: RES 0402)
R?#25  Package / Case: 0402  Resistance: NM  [RES_0402]  (hidden comment: RES 0402)
R?#26  Package / Case: 0402  Resistance: NM  [RES_0402]  (hidden comment: RES 0402)
R?#27  Package / Case: 0402  Resistance: NM  [RES_0402]  (hidden comment: RES 0402)
R?#28  Package / Case: 0402  Resistance: NM  [RES_0402]  (hidden comment: RES 0402)
R?#29  Package / Case: 0402  Resistance: NM  [RES_0402]  (hidden comment: RES 0402)
R?#30  Package / Case: 0402  Resistance: NM  [RES_0402]  (hidden comment: RES 0402)
R?#31  Package / Case: 0402  Resistance: NM  [RES_0402]  (hidden comment: RES 0402)
U?#7  DP83848MPHPREP  [TI_PHY_DP83848-EP]  (part B of 2)
U?#8  DP83848MPHPREP  [TI_PHY_DP83848-EP]  (part A of 2)

### Nets
GND: C?#31.1 C?#32.1 C?#33.1 C?#34.1 C?#35.1 C?#36.1 C?#37.1 C?#38.1 C?#39.1 C?#40.1 C?#41.1 J?#2.8(CGND) R?#29.1 U?#7.15(AGND) U?#7.19(AGND) U?#7.35(IOGND) U?#7.36(DGND) U?#7.47(IOGND) U?#7.49(GNDPAD)
RTDC: C?#31.2 C?#32.2 C?#33.2 C?#34.2 C?#35.2 C?#36.2 C?#37.2 J?#2.4(TDC) J?#2.5(RDC) R?#21.2 R?#22.1 R?#23.2 R?#24.1 R?#25.2 R?#26.2 R?#27.2 R?#28.2 U?#7.22(AVDD33) U?#7.32(IOVDD33) U?#7.48(IOVDD33)  [also labelled +3V3]
ETH_MDC: U?#8.31(MDC)
ETH_MDIO: U?#8.30(MDIO)
ETH_RXD0: U?#8.43(RXD_0_PHYAD1)
ETH_RXD1: U?#8.44(RXD_1_PHYAD2)
ETH_TXD0: U?#8.3(TXD_0)
ETH_TXD1: U?#8.4(TXD_1)
ETH_TXEN: U?#8.2(TX_EN)
LED_ACK_LINK: U?#8.26(LED_ACT_COL_AN_EN)
LED_LINK: U?#8.28(LED_LINK_AN0)
LED_SPEED: U?#8.27(LED_SPEED_AN1)
PFBIN1: C?#38.2 U?#8.18(PFBIN1)
PFBIN2: C?#40.2 C?#41.2 U?#8.37(PFBIN2)
PFBOUT: C?#39.2 U?#8.23(PFBOUT)
RDN: J?#2.6(RD-) R?#25.1 U?#8.13(RD_MINUS)
RDP: J?#2.3(RD+) R?#24.2 U?#8.14(RD_PLUS)
TDN: J?#2.2(TD-) R?#23.1 U?#8.16(TD_MINUS)
TDP: J?#2.1(TD+) R?#22.2 U?#8.17(TD_PLUS)
NetJ?#2_9: J?#2.9(LED_G_A) J?#2.12(LED_Y_A) R?#21.1
NetR?#26_1: R?#26.1 U?#8.29(RESET_N)
NetR?#27_1: R?#27.1 U?#8.40(CRS_CRS_DV_LED_CFG)
NetR?#28_1: R?#28.1 U?#8.39(RX_DV_MII_MODE)
NetR?#29_2: R?#29.2 U?#8.24(RBIAS)
NetR?#30_2: R?#30.2 U?#8.21(RESERVED)
NetR?#31_2: R?#31.2 U?#8.20(RESERVED)

Not connected (* = marked no-connect by the designer): J?#2 7(NC)* 10(LED_G_K) 11(LED_Y_K); R?#30 1; R?#31 1; U?#8 1(TX_CLK)* 5(TXD_2)* 6(TXD_3_SNI_MODE)* 7(PWR_DOWN_INT)* 8(TCK)* 9(TDO)* 10(TMS)* 11(TRST_N)* 12(TDI)* 25(25MHz_OUT)* 33(X2)* 34(X1) 38(RX_CLK)* 41(RX_ER_MDIX_EN)* 42(COL_PHYAD0)* 45(RXD_2_PHYAD3)* 46(RXD_3_PHYAD4)*

### Library data of the parts
C?#31-C?#34 C?#38-C?#41 = CAP_0402_NM: CAP, size 0402, NM, N/A; Supplier URL: N/A; Tolerance: N/A; Supplier: N/A; Supplier Part Number: N/A; ComponentLink1Description: Datasheet; ComponentLink1URL: N/A; Mount: SMD/SMT; Operating Temperature Max: + 85 C; Operating Temperature Min: - 40 C; Packaging: Tape and Reel; Voltage Rating DC: N/A; Capacitance: N/A
C?#35-C?#37 = CAP_0402_NM: as C?#20 on sheet [05] - USB HUB CONTROLLER; Supplier URL: https://www.thegioiic.com/tu-gom-0402-100nf-0-1uf-50v; Supplier: thegioiic; Supplier Part Number: Tụ Gốm 0402 100nF (0.1uF) 50V; ComponentLink1Description: Datasheet; ComponentLink1URL: N/A; Mount: SMD/SMT; Operating Temperature Max: + 85 C; Operating Temperature Min: - 40 C; Packaging: Tape and Reel
J?#2 = CONN_RJ45-HR911105A: Single Port RJ45 Connector w/ Integrated Magnetic and LED 10/100 Base-T; Manufacturer: HanRun; Manufacturer Part Number: HR911105A
R?#21-R?#31 = RES_0402_NM: RES, size 0402, NM, N/A; Supplier backup URL: N/A; Packaging: Tape and Reel; Supplier: N/A; Supplier Part Number: N/A; Supplier backup: N/A; Supplier backup Part Number: N/A; Manufacturer: N/A; Manufacturer Part Number: N/A; ComponentLink1Description: Datasheet; ComponentLink1URL: N/A; Mount: SMD/SMT; Operating Temperature Max: + 85 C; Operating Temperature Min: - 40 C; LCSC Part #: N/A; Supplier URL: N/A; Tolerance: N/A; Rated Power: N/A
U?#7 U?#8 = IC_DP83848MPHPREP: Enhanced Product PHYTER extreme temperature single port 10/100 Mb/s Ethernet physical layer 48-HTQFP -55 to 125; Manufacturer_Name: Texas Instruments; Alternate_Manufacturer: None; CurrentTime: Not shown in title block; DocumentNumber: 1; SymbolCreator: a0411947; CompType: IC; U/M: EA; Designator: U?; Copyright: Copyright (C) 2025 Ultra Librarian. All rights reserved.; Manufacturer_Part_Number: DP83848MPHPREP; CurrentDate: Not shown in title block; Time: Not shown in title block; Date: Not shown in title block; DocumentFullPathAndName: Not shown in title block; DocumentName: Not shown in title block; ModifiedDate: Not shown in title block; ApprovedBy: Not shown in title block; CheckedBy: Not shown in title block; Author: Not shown in title block; CompanyName: Not shown in title block; Engineer: Not shown in title block; Organization: Not shown in title block; Address1: Not shown in title block; Address2: Not shown in title block; Address3: Not shown in title block; Address4: Not shown in title block; Revision: Use project parameter SCH_Rev; SheetNumber: 1; SheetTotal: 1; ImagePath: Not shown in title block; Rule: *; ProjectName: *; SymbolVersion: 2014-04-03; PartNumber: DP83848MPHPREP; PackageReference: PHP0048F; MountType: SMT; ComponentLink1Description: Datasheet Link; ComponentLink1URL: https://sps06.itg.ti.com/sites/KMS/crossdivteams/altium/docs/ComponentDatasheets/dp83848-ep.pdf; RoHS: Y; Publisher: Texas Instruments; LatestRevisionDate: 2014-04-03; Manufacturer: Texas Instruments; Refdes: Refdes; Type: Type

## Sheet [06] - USB HIGHSPEED PHY.SchDoc
size A4; SheetNumber: 7; SheetTotal: 10
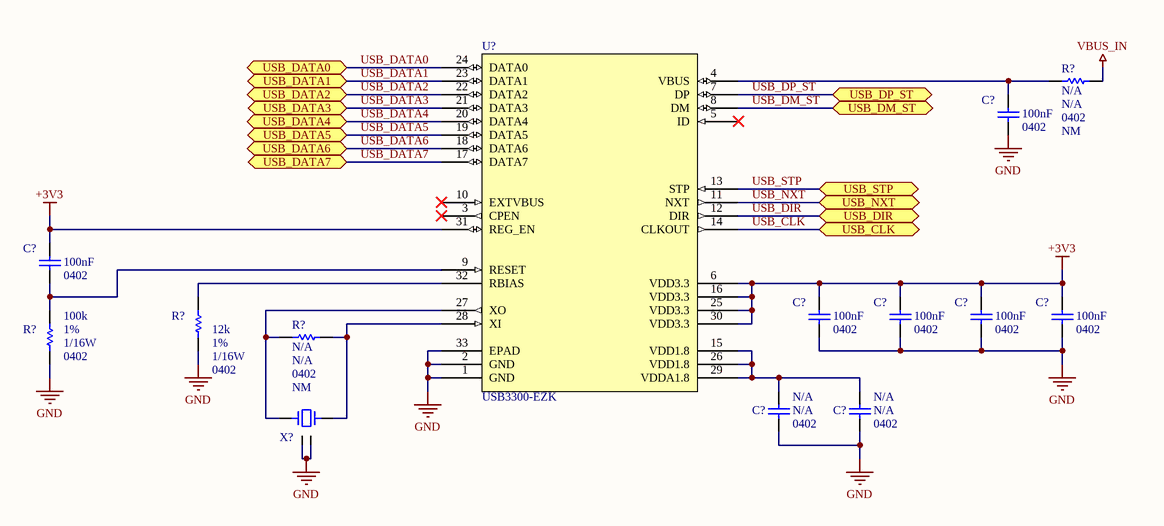
[diagram p5: [06] - USB HIGHSPEED PHY.SchDoc]

### Parts
(Parts that share a designator on the sheet are numbered #1, #2 ... from top to bottom, then left to right.)
C?#42  Package / Case: 0402  Capacitance: 100nF  [CAP_0402]  (hidden comment: CAP 0402)
C?#43  Package / Case: 0402  Capacitance: 100nF  [CAP_0402]  (hidden comment: CAP 0402)
C?#44  Package / Case: 0402  Capacitance: 100nF  [CAP_0402]  (hidden comment: CAP 0402)
C?#45  Package / Case: 0402  Capacitance: 100nF  [CAP_0402]  (hidden comment: CAP 0402)
C?#46  Package / Case: 0402  Capacitance: 100nF  [CAP_0402]  (hidden comment: CAP 0402)
C?#47  Package / Case: 0402  Capacitance: 100nF  [CAP_0402]  (hidden comment: CAP 0402)
C?#48  Package / Case: 0402  [CAP_0402]  (hidden comment: CAP 0402)
C?#49  Package / Case: 0402  [CAP_0402]  (hidden comment: CAP 0402)
R?#32  Package / Case: 0402  Resistance: NM  [RES_0402]  (hidden comment: RES 0402)
R?#33  Tolerance: 1%  Rated Power: 1/16W  Package / Case: 0402  Resistance: 12k  [RES_0402]  (hidden comment: RES 0402)
R?#34  Package / Case: 0402  Resistance: NM  [RES_0402]  (hidden comment: RES 0402)
R?#35  Tolerance: 1%  Rated Power: 1/16W  Package / Case: 0402  Resistance: 100k  [RES_0402]  (hidden comment: RES 0402)
U?#9  USB3300-EZK  [PKG_QFN-32-5X5]
X?  XTAL_2016  [XTAL_2016]  (value not drawn)

### Ports
USB_CLK (bidir), USB_DATA0 (bidir), USB_DATA1 (bidir), USB_DATA2 (bidir), USB_DATA3 (bidir), USB_DATA4 (bidir), USB_DATA5 (bidir), USB_DATA6 (bidir), USB_DATA7 (bidir), USB_DIR (bidir), USB_DM_ST (bidir), USB_DP_ST (bidir), USB_NXT (bidir), USB_STP (bidir)

### Nets
+3V3: C?#43.2 C?#44.2 C?#45.2 C?#46.2 C?#47.2 U?#9.6(VDD3.3) U?#9.16(VDD3.3) U?#9.25(VDD3.3) U?#9.30(VDD3.3) U?#9.31(REG_EN)  [project net RTDC]
GND: C?#42.1 C?#44.1 C?#45.1 C?#46.1 C?#47.1 C?#48.1 C?#49.1 R?#33.2 R?#35.1 U?#9.1(GND) U?#9.2(GND) U?#9.33(EPAD) X?.2 X?.4
VBUS_IN: R?#32.1
USB_CLK: U?#9.14(CLKOUT) ; port USB_CLK
USB_DATA0: U?#9.24(DATA0) ; port USB_DATA0
USB_DATA1: U?#9.23(DATA1) ; port USB_DATA1
USB_DATA2: U?#9.22(DATA2) ; port USB_DATA2
USB_DATA3: U?#9.21(DATA3) ; port USB_DATA3
USB_DATA4: U?#9.20(DATA4) ; port USB_DATA4
USB_DATA5: U?#9.19(DATA5) ; port USB_DATA5
USB_DATA6: U?#9.18(DATA6) ; port USB_DATA6
USB_DATA7: U?#9.17(DATA7) ; port USB_DATA7
USB_DIR: U?#9.12(DIR) ; port USB_DIR
USB_DM_ST: U?#9.8(DM) ; port USB_DM_ST
USB_DP_ST: U?#9.7(DP) ; port USB_DP_ST
USB_NXT: U?#9.11(NXT) ; port USB_NXT
USB_STP: U?#9.13(STP) ; port USB_STP
NetC?#42_2: C?#42.2 R?#32.2 U?#9.4(VBUS)
NetC?#43_1: C?#43.1 R?#35.2 U?#9.9(RESET)
NetC?#48_2: C?#48.2 C?#49.2 U?#9.15(VDD1.8) U?#9.26(VDD1.8) U?#9.29(VDDA1.8)
NetR?#33_1: R?#33.1 U?#9.32(RBIAS)
NetR?#34_1: R?#34.1 U?#9.28(XI) X?.3
NetR?#34_2: R?#34.2 U?#9.27(XO) X?.1

Not connected (* = marked no-connect by the designer): U?#9 3(CPEN)* 5(ID)* 10(EXTVBUS)*

### Library data of the parts
C?#42-C?#47 = CAP_0402_NM: as C?#20 on sheet [05] - USB HUB CONTROLLER; Supplier URL: https://www.thegioiic.com/tu-gom-0402-100nf-0-1uf-50v; Supplier: thegioiic; Supplier Part Number: Tụ Gốm 0402 100nF (0.1uF) 50V; ComponentLink1Description: Datasheet; ComponentLink1URL: N/A; Mount: SMD/SMT; Operating Temperature Max: + 85 C; Operating Temperature Min: - 40 C; Packaging: Tape and Reel
C?#48 C?#49 = CAP_0402_NM: CAP, size 0402, NM, N/A; Supplier URL: N/A; Tolerance: N/A; Supplier: N/A; Supplier Part Number: N/A; ComponentLink1Description: Datasheet; ComponentLink1URL: N/A; Mount: SMD/SMT; Operating Temperature Max: + 85 C; Operating Temperature Min: - 40 C; Packaging: Tape and Reel; Voltage Rating DC: N/A; Capacitance: N/A
R?#32 R?#34 = RES_0402_NM: RES, size 0402, NM, N/A; Supplier backup URL: N/A; Packaging: Tape and Reel; Supplier: N/A; Supplier Part Number: N/A; Supplier backup: N/A; Supplier backup Part Number: N/A; Manufacturer: N/A; Manufacturer Part Number: N/A; ComponentLink1Description: Datasheet; ComponentLink1URL: N/A; Mount: SMD/SMT; Operating Temperature Max: + 85 C; Operating Temperature Min: - 40 C; LCSC Part #: N/A; Supplier URL: N/A; Tolerance: N/A; Rated Power: N/A
R?#33 R?#35 = RES_0402_NM: as R?#15 on sheet [05] - USB HUB CONTROLLER; Supplier backup URL: N/A; Packaging: Tape and Reel; Supplier backup: N/A; Supplier backup Part Number: N/A; Manufacturer Part Number: N/A; ComponentLink1Description: Datasheet; ComponentLink1URL: N/A; Mount: SMD/SMT; Operating Temperature Max: + 85 C; Operating Temperature Min: - 40 C
  R?#33: Supplier: CXT; Supplier Part Number: C020903; Supplier URL: https://linhkien.cxtvn.com/4697-dien-tro-0402-1-thong-so-tu-1k-den-91k.html
  R?#35: Supplier: thegioiic; Supplier Part Number: Điện Trở 100 KOhm 0402 1%; Supplier URL: https://www.thegioiic.com/dien-tro-100-kohm-0402-1-
U?#9 = IC_USB3300-EZK: Description; Manufacturer_Name: Microchip; Copyright: Copyright (C) 2025 Ultra Librarian. All rights reserved.; Manufacturer_Part_Number: USB3300-EZK; RefDes: RefDes; Type: Type
X? = XTAL_SMD_4PIN: Crystal SMD 4-Pin 2.0x1.6mm; Distributor Link: *

## Sheet [04] - USB PORTS.SchDoc
size A3; SheetNumber: 4; SheetTotal: 9
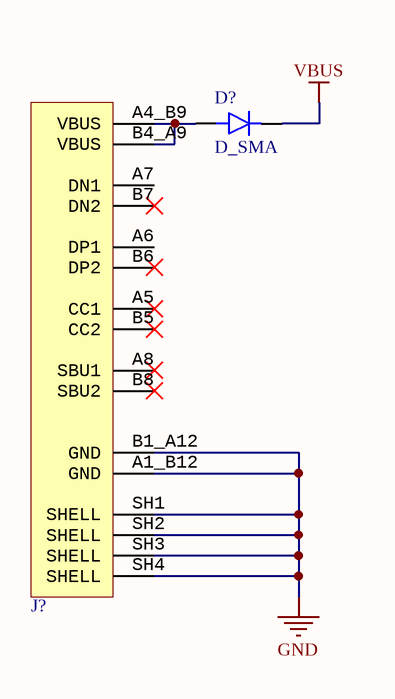
[diagram p6: [04] - USB PORTS.SchDoc]

### Parts
(Parts that share a designator on the sheet are numbered #1, #2 ... from top to bottom, then left to right.)
D?#8  D_SMA  [DO-214AC-2 (SMA)]
J?#3  CONN_USB_TYPEC_16PIN  [CONN_USB_TYPEC_16PIN]  (value not drawn)

### Nets
GND: J?#3.A1_B12(GND) J?#3.B1_A12(GND) J?#3.SH1(SHELL) J?#3.SH2(SHELL) J?#3.SH3(SHELL) J?#3.SH4(SHELL)
VBUS: D?#8.K
NetD?#8_A: D?#8.A J?#3.A4_B9(VBUS) J?#3.B4_A9(VBUS)

Not connected (* = marked no-connect by the designer): J?#3 A5(CC1)* A6(DP1) A7(DN1) A8(SBU1)* B5(CC2)* B6(DP2)* B7(DN2)* B8(SBU2)*

### Library data of the parts
D?#8 = D_SMA: Diode SMD SMA (DO-214AA)
J?#3 = CONN_USB_TYPEC_16PIN: USB-C (USB TYPE-C) USB 2.0 Receptacle Connector 24 (16+8 Dummy) Position Surface Mount, Right Angle; Through Hole; MP: USB4105-GF-A; Value: USB-C 2.0 24-Pin (16+8 Dummy); Package: None; Price: None; Availability: Unavailable; ComponentLink1Description: Buy; ComponentLink1URL: https://www.thegioiic.com/cong-usb-cai-3-1-type-c-16-chan-thang-dan-smd; Supplier: N/A; Supplier PN: N/A; Supplier URL: *

## Sheet [08] - MCU.SchDoc
size A3; SheetNumber: 8; SheetTotal: 9
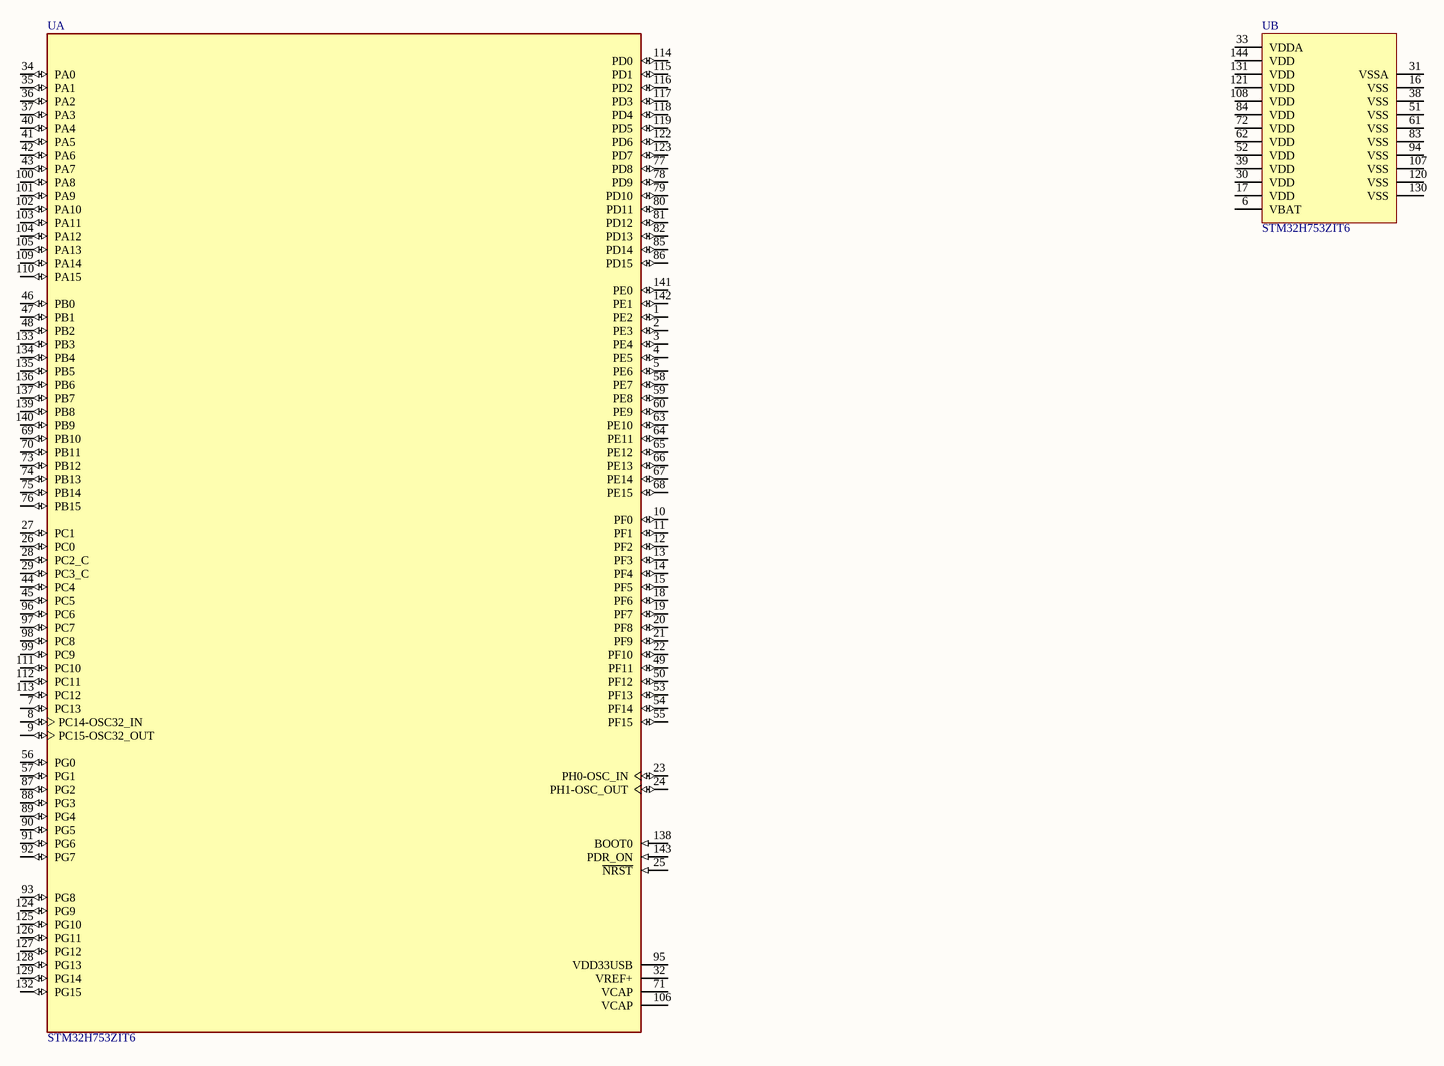
[diagram p7: [08] - MCU.SchDoc]

### Parts
U  STM32H753ZIT6  [ST_MCU_STM32H753ZIT6_LQFP144]  (parts A,B of 2)

### Nets

Not connected (* = marked no-connect by the designer): U 1(PE2) 2(PE3) 3(PE4) 4(PE5) 5(PE6) 6(VBAT) 7(PC13) 8(PC14-OSC32_IN) 9(PC15-OSC32_OUT) 10(PF0) 11(PF1) 12(PF2) 13(PF3) 14(PF4) 15(PF5) 16(VSS) 17(VDD) 18(PF6) 19(PF7) 20(PF8) 21(PF9) 22(PF10) 23(PH0-OSC_IN) 24(PH1-OSC_OUT) 25(~{NRST}) 26(PC0) 27(PC1) 28(PC2_C) 29(PC3_C) 30(VDD) 31(VSSA) 32(VREF+) 33(VDDA) 34(PA0) 35(PA1) 36(PA2) 37(PA3) 38(VSS) 39(VDD) 40(PA4) 41(PA5) 42(PA6) 43(PA7) 44(PC4) 45(PC5) 46(PB0) 47(PB1) 48(PB2) 49(PF11) 50(PF12) 51(VSS) 52(VDD) 53(PF13) 54(PF14) 55(PF15) 56(PG0) 57(PG1) 58(PE7) 59(PE8) 60(PE9) 61(VSS) 62(VDD) 63(PE10) 64(PE11) 65(PE12) 66(PE13) 67(PE14) 68(PE15) 69(PB10) 70(PB11) 71(VCAP) 72(VDD) 73(PB12) 74(PB13) 75(PB14) 76(PB15) 77(PD8) 78(PD9) 79(PD10) 80(PD11) 81(PD12) 82(PD13) 83(VSS) 84(VDD) 85(PD14) 86(PD15) 87(PG2) 88(PG3) 89(PG4) 90(PG5) 91(PG6) 92(PG7) 93(PG8) 94(VSS) 95(VDD33USB) 96(PC6) 97(PC7) 98(PC8) 99(PC9) 100(PA8) 101(PA9) 102(PA10) 103(PA11) 104(PA12) 105(PA13) 106(VCAP) 107(VSS) 108(VDD) 109(PA14) 110(PA15) 111(PC10) 112(PC11) 113(PC12) 114(PD0) 115(PD1) 116(PD2) 117(PD3) 118(PD4) 119(PD5) 120(VSS) 121(VDD) 122(PD6) 123(PD7) 124(PG9) 125(PG10) 126(PG11) 127(PG12) 128(PG13) 129(PG14) 130(VSS) 131(VDD) 132(PG15) 133(PB3) 134(PB4) 135(PB5) 136(PB6) 137(PB7) 138(BOOT0) 139(PB8) 140(PB9) 141(PE0) 142(PE1) 143(PDR_ON) 144(VDD)

### Library data of the parts
U = STM32H753ZIT6: ARMÂ® CortexÂ®-M7 STM32H7 Microcontroller IC 32-Bit 480MHz 2MB _2M x 8_ FLASH 144-LQFP _20x20_; MF: STMicroelectronics; Package: LQFP-144 STMicroelectronics; Value: *; SnapEDA_Link: https://www.snapeda.com/parts/STM32H753ZIT6/STMicroelectronics/view-part/2461811/?ref=snap; MP: STM32H753ZIT6; Supplier: Mouser; Supplier URL: https://www.mouser.vn/ProductDetail/STMicroelectronics/STM32H753ZIT6?qs=u4fy%2FsgLU9PzR9vtNNw%2FMw%3D%3D; ComponentLink1Description: Datasheet; ComponentLink1URL: https://www.st.com/resource/en/datasheet/stm32h753vi.pdf

## Nets that join several sheets
GND: [03] - POWER SUPPLY (28 pins), [05] - USB HUB CONTROLLER (18 pins), [07] - ETHERNET CONTROLLER (19 pins), [06] - USB HIGHSPEED PHY (14 pins), [04] - USB PORTS (6 pins)
RTDC: [03] - POWER SUPPLY (10 pins), [05] - USB HUB CONTROLLER (15 pins), [07] - ETHERNET CONTROLLER (20 pins), [06] - USB HIGHSPEED PHY (10 pins)